# EAGLE design M868pld (EAGLE 6.6.0)
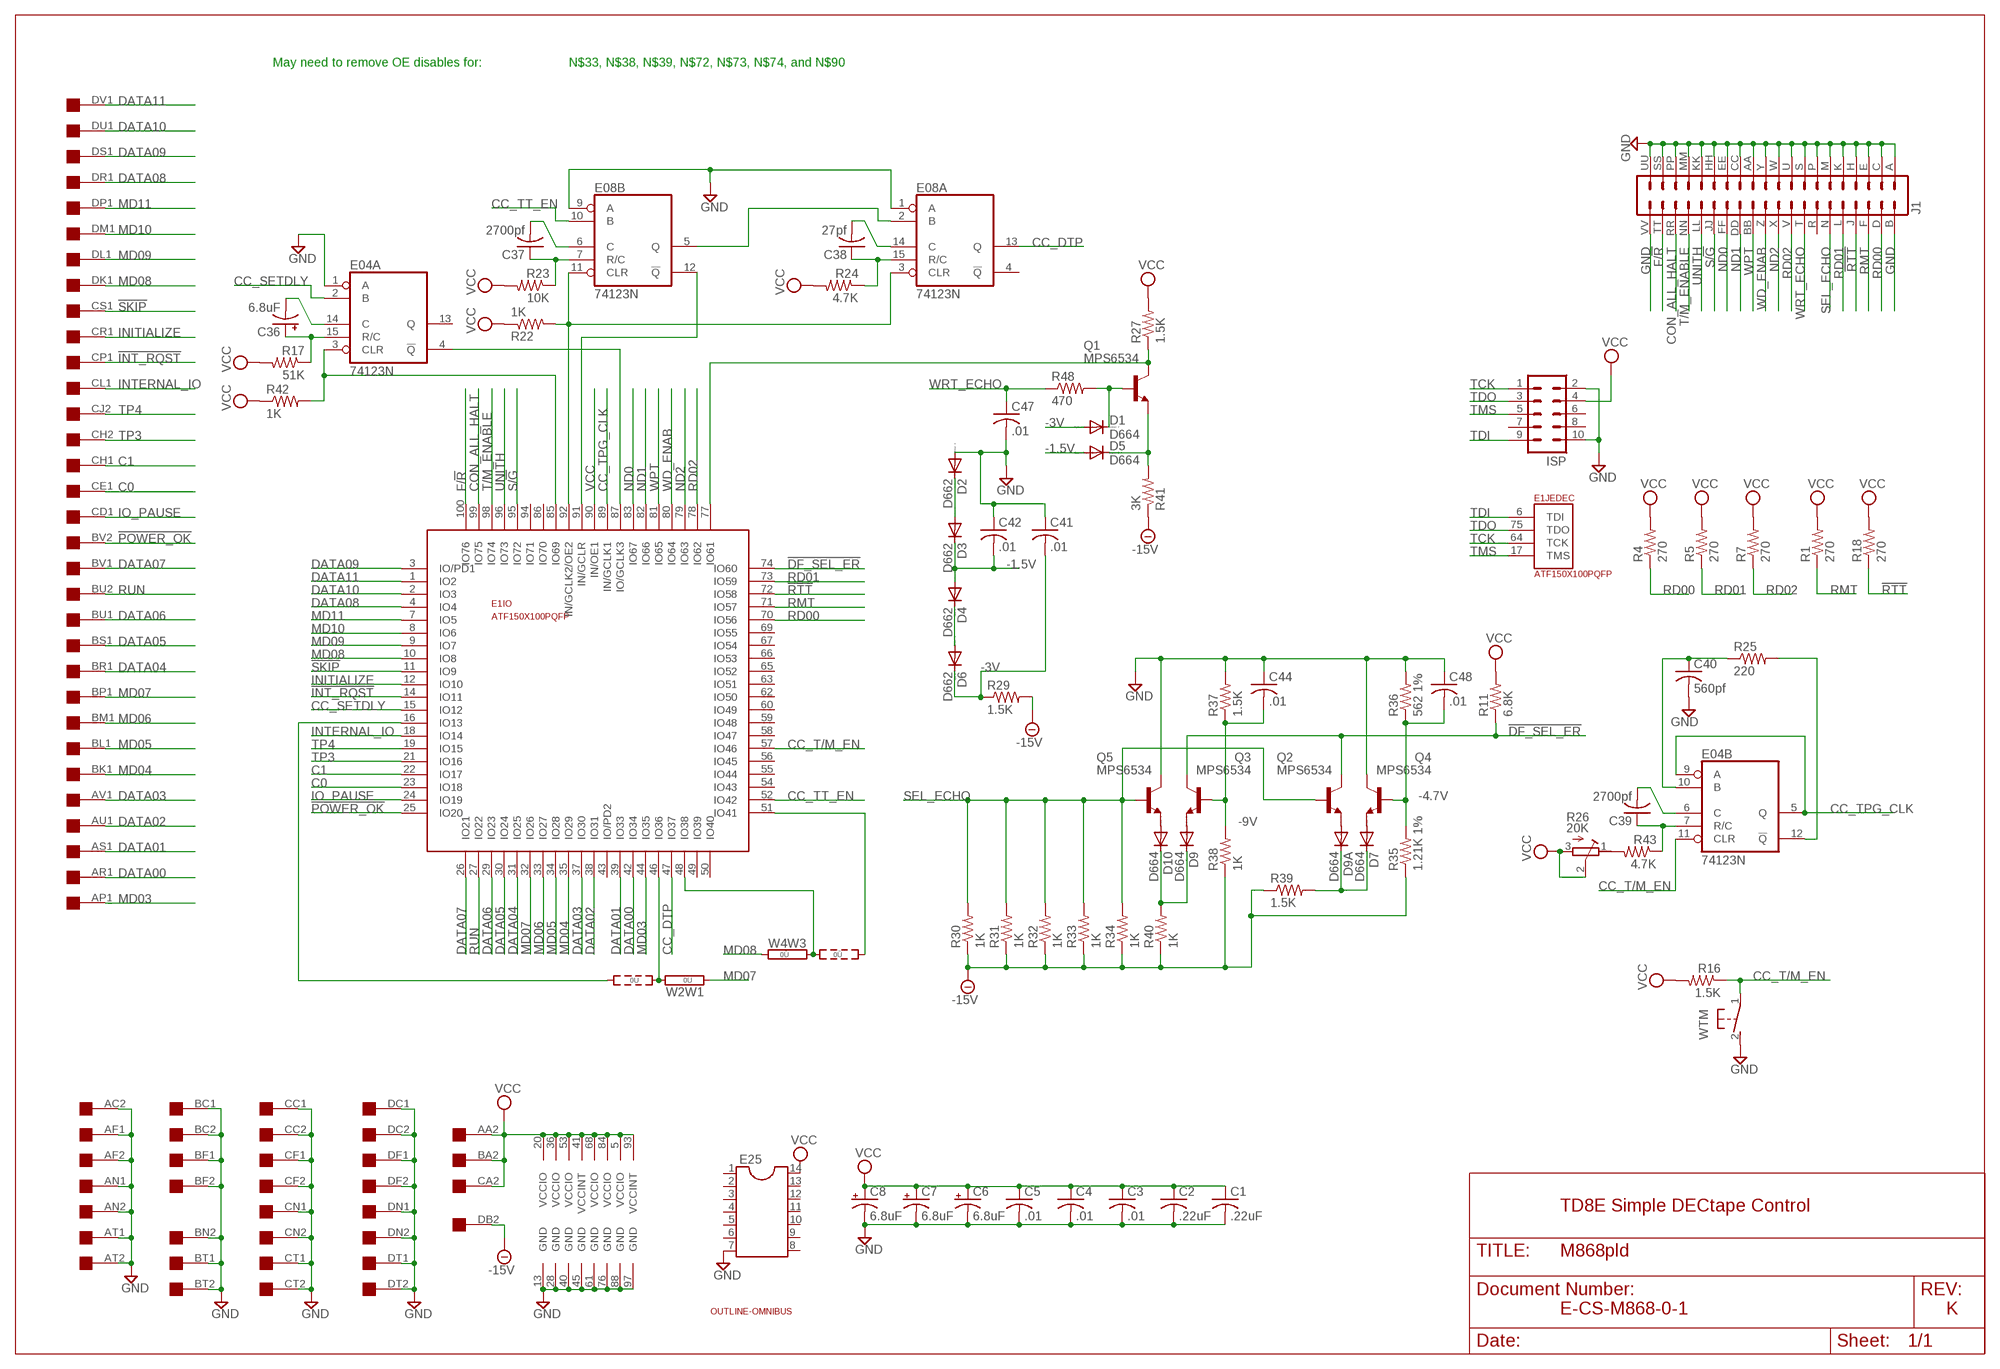
[diagram p0: schematic, sheet 1]

## Parts
C1  .22uF  C-US050-025X075  [C050-025X075]
C2  .22uF  C-US050-025X075  [C050-025X075]
C3  .01  C-US050-025X075  [C050-025X075]
C4  .01  C-US050-025X075  [C050-025X075]
C5  .01  C-US050-025X075  [C050-025X075]
C6  6.8uF  CPOL-USE20-8AXIAL  [E12-8]
C7  6.8uF  CPOL-USE20-8AXIAL  [E12-8]
C8  6.8uF  CPOL-USE20-8AXIAL  [E12-8]
C36  6.8uF  CPOL-USE20-8AXIAL  [E12-8]
C37  2700pf  C-US102-043X133  [C102-043X133]
C38  27pf  C-US050-025X075  [C050-025X075]
C39  2700pf  C-US102-043X133  [C102-043X133]
C40  560pf  C-US075-032X103  [C075-032X103]
C41  .01  C-US050-025X075  [C050-025X075]
C42  .01  C-US050-025X075  [C050-025X075]
C44  .01  C-US050-025X075  [C050-025X075]
C47  .01  C-US050-025X075  [C050-025X075]
C48  .01  C-US050-025X075  [C050-025X075]
D1  D664  1N4148DO35-10  [DO35-10]
D2  D662  1N4148DO35-10  [DO35-10]
D3  D662  1N4148DO35-10  [DO35-10]
D4  D662  1N4148DO35-10  [DO35-10]
D5  D664  1N4148DO35-10  [DO35-10]
D6  D662  1N4148DO35-10  [DO35-10]
D7  D664  1N4148DO35-10  [DO35-10]
D9  D664  1N4148DO35-10  [DO35-10]
D9A  D664  1N4148DO35-10  [DO35-10]
D10  D664  1N4148DO35-10  [DO35-10]
E1  ATF150X100PQFP  [PQFP-100]
E04  74123N  [DIL16]
E08  74123N  [DIL16]
E25  DIL14  [DIL14]
EDGE$3  QUAD  [EDGE-CON8]
ISP  MA05-2  [MA05-2]
J1  DEC40PINH  [DEC40PINH]
Q1  MPS6534  2N2219  [TO5]
Q2  MPS6534  2N2219  [TO5]
Q3  MPS6534  2N2219  [TO5]
Q4  MPS6534  2N2219  [TO5]
Q5  MPS6534  2N2219  [TO5]
R1  270  R-US_0207/10  [0207/10]
R4  270  R-US_0207/10  [0207/10]
R5  270  R-US_0207/10  [0207/10]
R7  270  R-US_0207/10  [0207/10]
R11  6.8K  R-US_0207/10  [0207/10]
R16  1.5K  R-US_0207/10  [0207/10]
R17  51K  R-US_0207/10  [0207/10]
R18  270  R-US_0207/10  [0207/10]
R22  1K  R-US_0207/10  [0207/10]
R23  10K  R-US_0207/10  [0207/10]
R24  4.7K  R-US_0207/10  [0207/10]
R25  220  R-US_0207/10  [0207/10]
R26  20K  275P  [3006Y]
R27  1.5K  R-US_0207/10  [0207/10]
R29  1.5K  R-US_0207/10  [0207/10]
R30  1K  R-US_0207/10  [0207/10]
R31  1K  R-US_0207/10  [0207/10]
R32  1K  R-US_0207/10  [0207/10]
R33  1K  R-US_0207/10  [0207/10]
R34  1K  R-US_0207/10  [0207/10]
R35  1.21K 1%  R-US_0207/15  [0207/15]
R36  562 1%  R-US_0207/15  [0207/15]
R37  1.5K  R-US_0207/10  [0207/10]
R38  1K  R-US_0207/10  [0207/10]
R39  1.5K  R-US_0207/10  [0207/10]
R40  1K  R-US_0207/10  [0207/10]
R41  3K  R-US_0207/10  [0207/10]
R42  1K  R-US_0207/10  [0207/10]
R43  4.7K  R-US_0207/10  [0207/10]
R48  470  R-US_0207/10  [0207/10]
U$1  OUTLINE-OMNIBUS  [OMNIBUS]
W2W1  0R2  [0R2/10]
W4W3  0R2  [0R2/10]
WTM  31-XX  [B3F-31XX]

## Nets
!CC_TPG_CLK: C40.1 E04.10(B:B) R25.1
!DF_SEL_ER: E1.74(IO:IO60) Q2.3(C) Q3.3(C) R11.1
!INT_RQST: E1.14(IO:IO11) EDGE$3.CP1
!POWER_OK: E1.25(IO:IO20) EDGE$3.BV2
!RTT: E1.72(IO:IO58) J1.J R18.1
!SKIP: E1.11(IO:IO9) EDGE$3.CS1
-1.5V: C42.2 D3.C D4.A D5.A
-3V: C41.2 D1.A D6.C R29.1
-4.7V: C48.2 Q4.2(B) R35.2 R36.1
-9V: C44.2 Q3.2(B) R37.1 R38.2
-15V [supply]: EDGE$3.DB2 R29.2 R30.1 R31.1 R32.1 R33.1 R34.1 R35.1 R38.1 R39.1 R40.1 R41.1
C0: E1.23(IO:IO18) EDGE$3.CE1
C1: E1.22(IO:IO17) EDGE$3.CH1
CC_DTP: E1.47(IO:IO37) E08.13(A:Q)
CC_SETDLY: E1.15(IO:IO12) E04.2(A:B)
CC_T/M_EN: E1.57(IO:IO46) E04.11(B:CLR) R16.1 WTM.1(P)
CC_TPG_CLK: E1.89(IO:IN/GCLK1) E04.5(B:Q) E04.9(B:A)
CC_TT_EN: E1.52(IO:IO42) E08.10(B:B)
CON_ALL_HALT: E1.99(IO:IO75) J1.RR
DATA00: E1.42(IO:IO34) EDGE$3.AR1
DATA01: E1.39(IO:IO33) EDGE$3.AS1
DATA02: E1.38(IO:IO31) EDGE$3.AU1
DATA03: E1.37(IO:IO30) EDGE$3.AV1
DATA04: E1.31(IO:IO25) EDGE$3.BR1
DATA05: E1.30(IO:IO24) EDGE$3.BS1
DATA06: E1.29(IO:IO23) EDGE$3.BU1
DATA07: E1.26(IO:IO21) EDGE$3.BV1
DATA08: E1.4(IO:IO4) EDGE$3.DR1
DATA09: E1.3(IO:IO/PD1) EDGE$3.DS1
DATA10: E1.2(IO:IO3) EDGE$3.DU1
DATA11: E1.1(IO:IO2) EDGE$3.DV1
F/!R: E1.100(IO:IO76) J1.TT
GND: C1.2 C2.2 C3.2 C4.2 C5.2 C6.- C7.- C8.- C40.2 C41.1 C42.1 C44.1 C47.2 C48.1 D2.A E1.13(GND) E1.28(GND) E1.40(GND) E1.45(GND) E1.61(GND) E1.76(GND) E1.88(GND) E1.97(GND) E04.1(A:A) E08.1(A:A) E08.9(B:A) E25.7 EDGE$3.AC2 EDGE$3.AF1 EDGE$3.AF2 EDGE$3.AN1 EDGE$3.AN2 EDGE$3.AT1 EDGE$3.AT2 EDGE$3.BC1 EDGE$3.BC2 EDGE$3.BF1 EDGE$3.BF2 EDGE$3.BN2 EDGE$3.BT1 EDGE$3.BT2 EDGE$3.CC1 EDGE$3.CC2 EDGE$3.CF1 EDGE$3.CF2 EDGE$3.CN1 EDGE$3.CN2 EDGE$3.CT1 EDGE$3.CT2 EDGE$3.DC1 EDGE$3.DC2 EDGE$3.DF1 EDGE$3.DF2 EDGE$3.DN1 EDGE$3.DN2 EDGE$3.DT1 EDGE$3.DT2 ISP.2 ISP.10 J1.A J1.AA J1.B J1.C J1.CC J1.E J1.EE J1.H J1.HH J1.K J1.KK J1.M J1.MM J1.P J1.PP J1.S J1.SS J1.U J1.UU J1.VV J1.W J1.Y Q4.3(C) Q5.3(C) R36.2 R37.2 WTM.2(S)
INITIALIZE: E1.12(IO:IO10) EDGE$3.CR1
INTERNAL_IO: E1.18(IO:IO14) EDGE$3.CL1
IO_PAUSE: E1.24(IO:IO19) EDGE$3.CD1
MD03: E1.44(IO:IO35) EDGE$3.AP1
MD04: E1.35(IO:IO29) EDGE$3.BK1
MD05: E1.34(IO:IO28) EDGE$3.BL1
MD06: E1.33(IO:IO27) EDGE$3.BM1
MD07: E1.32(IO:IO26) EDGE$3.BP1 W2W1.1
MD08: E1.10(IO:IO8) EDGE$3.DK1 W4W3.1
MD09: E1.9(IO:IO7) EDGE$3.DL1
MD10: E1.8(IO:IO6) EDGE$3.DM1
MD11: E1.7(IO:IO5) EDGE$3.DP1
N$17: E1.92(IO:IN/GCLK2/OE2) E08.3(A:CLR) E08.11(B:CLR) R22.2
N$51: D1.C Q1.2(B) R48.2
N$52: D5.C Q1.1(E) R41.2
N$53: E1.77(IO:IO61) Q1.3(C) R27.1
N$54: D2.C D3.A
N$55: D9.C D10.C R40.2
N$56: D4.C D6.A
N$57: D10.A Q5.1(E)
N$58: D9.A Q3.1(E)
N$59: D9A.A Q2.1(E)
N$60: D7.A Q4.1(E)
N$61: E1.46(IO:IO36) W2W1.2
N$62: E1.48(IO:IO38) W4W3.2
N$63: D7.C D9A.C R39.2
N$65: E1.16(IO:IO13) W2W1.3
N$67: E1.51(IO:IO41) W4W3.3
N$77: E08.2(A:B) E08.5(B:Q)
N$78: C37.1 E08.7(B:R/C) R23.1
N$79: C38.1 E08.15(A:R/C) R24.1
N$80: E1.91(IO:IN/GCLR) E08.12(B:!Q)
N$81: C38.2 E08.14(A:C)
N$82: C37.2 E08.6(B:C)
N$92: E1.85(IO:IO69) E04.3(A:CLR) R42.2
N$94: C36.+ E04.15(A:R/C) R17.1
N$95: C36.- E04.14(A:C)
N$96: E1.87(IO:IO/GCLK3) E04.4(A:!Q)
N$108: C39.1 E04.7(B:R/C) R43.1
N$110: C39.2 E04.6(B:C)
N$111: R26.1(A) R43.2
N$112: E04.12(B:!Q) R25.2
ND0: E1.83(IO:IO67) J1.FF
ND1: E1.82(IO:IO66) J1.DD
ND2: E1.79(IO:IO63) J1.X
RD00: E1.70(IO:IO56) J1.D R4.1
RD01: E1.73(IO:IO59) J1.L R5.1
RD02: E1.78(IO:IO62) J1.V R7.1
RMT: E1.71(IO:IO57) J1.F R1.1
RUN: E1.27(IO:IO22) EDGE$3.BU2
S/!G: E1.95(IO:IO72) J1.JJ
SEL_ECHO: J1.N Q2.2(B) Q5.2(B) R30.2 R31.2 R32.2 R33.2 R34.2
T/M_ENABLE: E1.98(IO:IO74) J1.NN
TCK: E1.64(JEDEC:TCK) ISP.1
TDI: E1.6(JEDEC:TDI) ISP.9
TDO: E1.75(JEDEC:TDO) ISP.3
TMS: E1.17(JEDEC:TMS) ISP.5
TP3: E1.21(IO:IO16) EDGE$3.CH2
TP4: E1.19(IO:IO15) EDGE$3.CJ2
UNITH: E1.96(IO:IO73) J1.LL
VCC [supply]: C1.1 C2.1 C3.1 C4.1 C5.1 C6.+ C7.+ C8.+ E1.5(VCCIO) E1.20(VCCIO) E1.36(VCCIO) E1.41(VCCINT) E1.53(VCCIO) E1.68(VCCIO) E1.84(VCCIO) E1.90(IO:IN/OE1) E1.93(VCCINT) E25.14 EDGE$3.AA2 EDGE$3.BA2 EDGE$3.CA2 ISP.4 R1.2 R4.2 R5.2 R7.2 R11.2 R16.2 R17.2 R18.2 R22.1 R23.2 R24.2 R26.2(S) R26.3(E) R27.2 R42.1
WD_ENAB: E1.80(IO:IO64) J1.Z
WPT: E1.81(IO:IO65) J1.BB
WRT_ECHO: C47.1 J1.T R48.1
Unconnected: E1.43(IO:IO/PD2) E1.49(IO:IO39) E1.50(IO:IO40) E1.54(IO:IO43) E1.55(IO:IO44) E1.56(IO:IO45) E1.58(IO:IO47) E1.59(IO:IO48) E1.60(IO:IO49) E1.62(IO:IO50) E1.63(IO:IO51) E1.65(IO:IO52) E1.66(IO:IO53) E1.67(IO:IO54) E1.69(IO:IO55) E1.86(IO:IO70) E1.94(IO:IO71) E04.13(A:Q) E08.4(A:!Q) E25.1 E25.2 E25.3 E25.4 E25.5 E25.6 E25.8 E25.9 E25.10 E25.11 E25.12 E25.13 EDGE$3.AA1 EDGE$3.AB1 EDGE$3.AB2 EDGE$3.AC1 EDGE$3.AD1 EDGE$3.AD2 EDGE$3.AE1 EDGE$3.AE2 EDGE$3.AH1 EDGE$3.AH2 EDGE$3.AJ1 EDGE$3.AJ2 EDGE$3.AK1 EDGE$3.AK2 EDGE$3.AL1 EDGE$3.AL2 EDGE$3.AM1 EDGE$3.AM2 EDGE$3.AP2 EDGE$3.AR2 EDGE$3.AS2 EDGE$3.AU2 EDGE$3.AV2 EDGE$3.BA1 EDGE$3.BB1 EDGE$3.BB2 EDGE$3.BD1 EDGE$3.BD2 EDGE$3.BE1 EDGE$3.BE2 EDGE$3.BH1 EDGE$3.BH2 EDGE$3.BJ1 EDGE$3.BJ2 EDGE$3.BK2 EDGE$3.BL2 EDGE$3.BM2 EDGE$3.BN1 EDGE$3.BP2 EDGE$3.BR2 EDGE$3.BS2 EDGE$3.CA1 EDGE$3.CB1 EDGE$3.CB2 EDGE$3.CD2 EDGE$3.CE2 EDGE$3.CJ1 EDGE$3.CK1 EDGE$3.CK2 EDGE$3.CL2 EDGE$3.CM1 EDGE$3.CM2 EDGE$3.CP2 EDGE$3.CR2 EDGE$3.CS2 EDGE$3.CU1 EDGE$3.CU2 EDGE$3.CV1 EDGE$3.CV2 EDGE$3.DA1 EDGE$3.DA2 EDGE$3.DB1 EDGE$3.DD1 EDGE$3.DD2 EDGE$3.DE1 EDGE$3.DE2 EDGE$3.DH1 EDGE$3.DH2 EDGE$3.DJ1 EDGE$3.DJ2 EDGE$3.DK2 EDGE$3.DL2 EDGE$3.DM2 EDGE$3.DP2 EDGE$3.DR2 EDGE$3.DS2 EDGE$3.DU2 EDGE$3.DV2 ISP.6 ISP.7 ISP.8 J1.R

## Notes on the sheet
- May need to remove OE disables for: | N$33, N$38, N$39, N$72, N$73, N$74, and N$90
- TD8E Simple DECtape Control
- E-CS-M868-0-1 | K

## Power pins joined to a net without a drawn wire
GND: E04.8(P:GND) E08.8(P:GND)
VCC: E04.16(P:VCC) E08.16(P:VCC)

## Library data of the parts
C1-C5 C37-C42 C44 C47 C48 = rcl:C-US: CAPACITOR, American symbol
C6-C8 C36 = dec-con:CPOL-USE20-8AXIAL: A 0.8 inch electrolytic.
D1-D7 D9 D9A D10 = diode:1N4148: DIODE high speed (Philips)
E1 = atmel-cpld:ATF150X100: ATF150x in 100 pin package.
E04 E08 = 74xx-us:74*123: Retriggerable monostable MULTIVIBRATOR
E25 = ic-package:DIL14: Dual In Line / Socket
EDGE$3 = dec-con:QUAD: Quad-Height DEC board
ISP = con-lstb:MA05-2: PIN HEADER; OC_FARNELL: unknown; OC_NEWARK: unknown
J1 = dec-con:DEC40PIN: PIN HEADER
Q1-Q5 = transistor-npn:2N2219: NPN Transistor
R1 R4 R5 R7 R11 R16-R18 R22-R25 R27 R29-R43 R48 = rcl:R-US_: RESISTOR, American symbol
R26 = dec-con:275P: Trimpot with 275P (3006Y) footprint.
U$1 = dec-con:OUTLINE-*: Board outlines for DEC boards.
W2W1 W4W3 = jumper:0R2: Bridge switch 0R 2 x 10mm
WTM = switch-omron:31-XX: OMRON SWITCH; MPN: B3F-3100; OC_FARNELL: 959704; OC_NEWARK: 36M3582

## Board
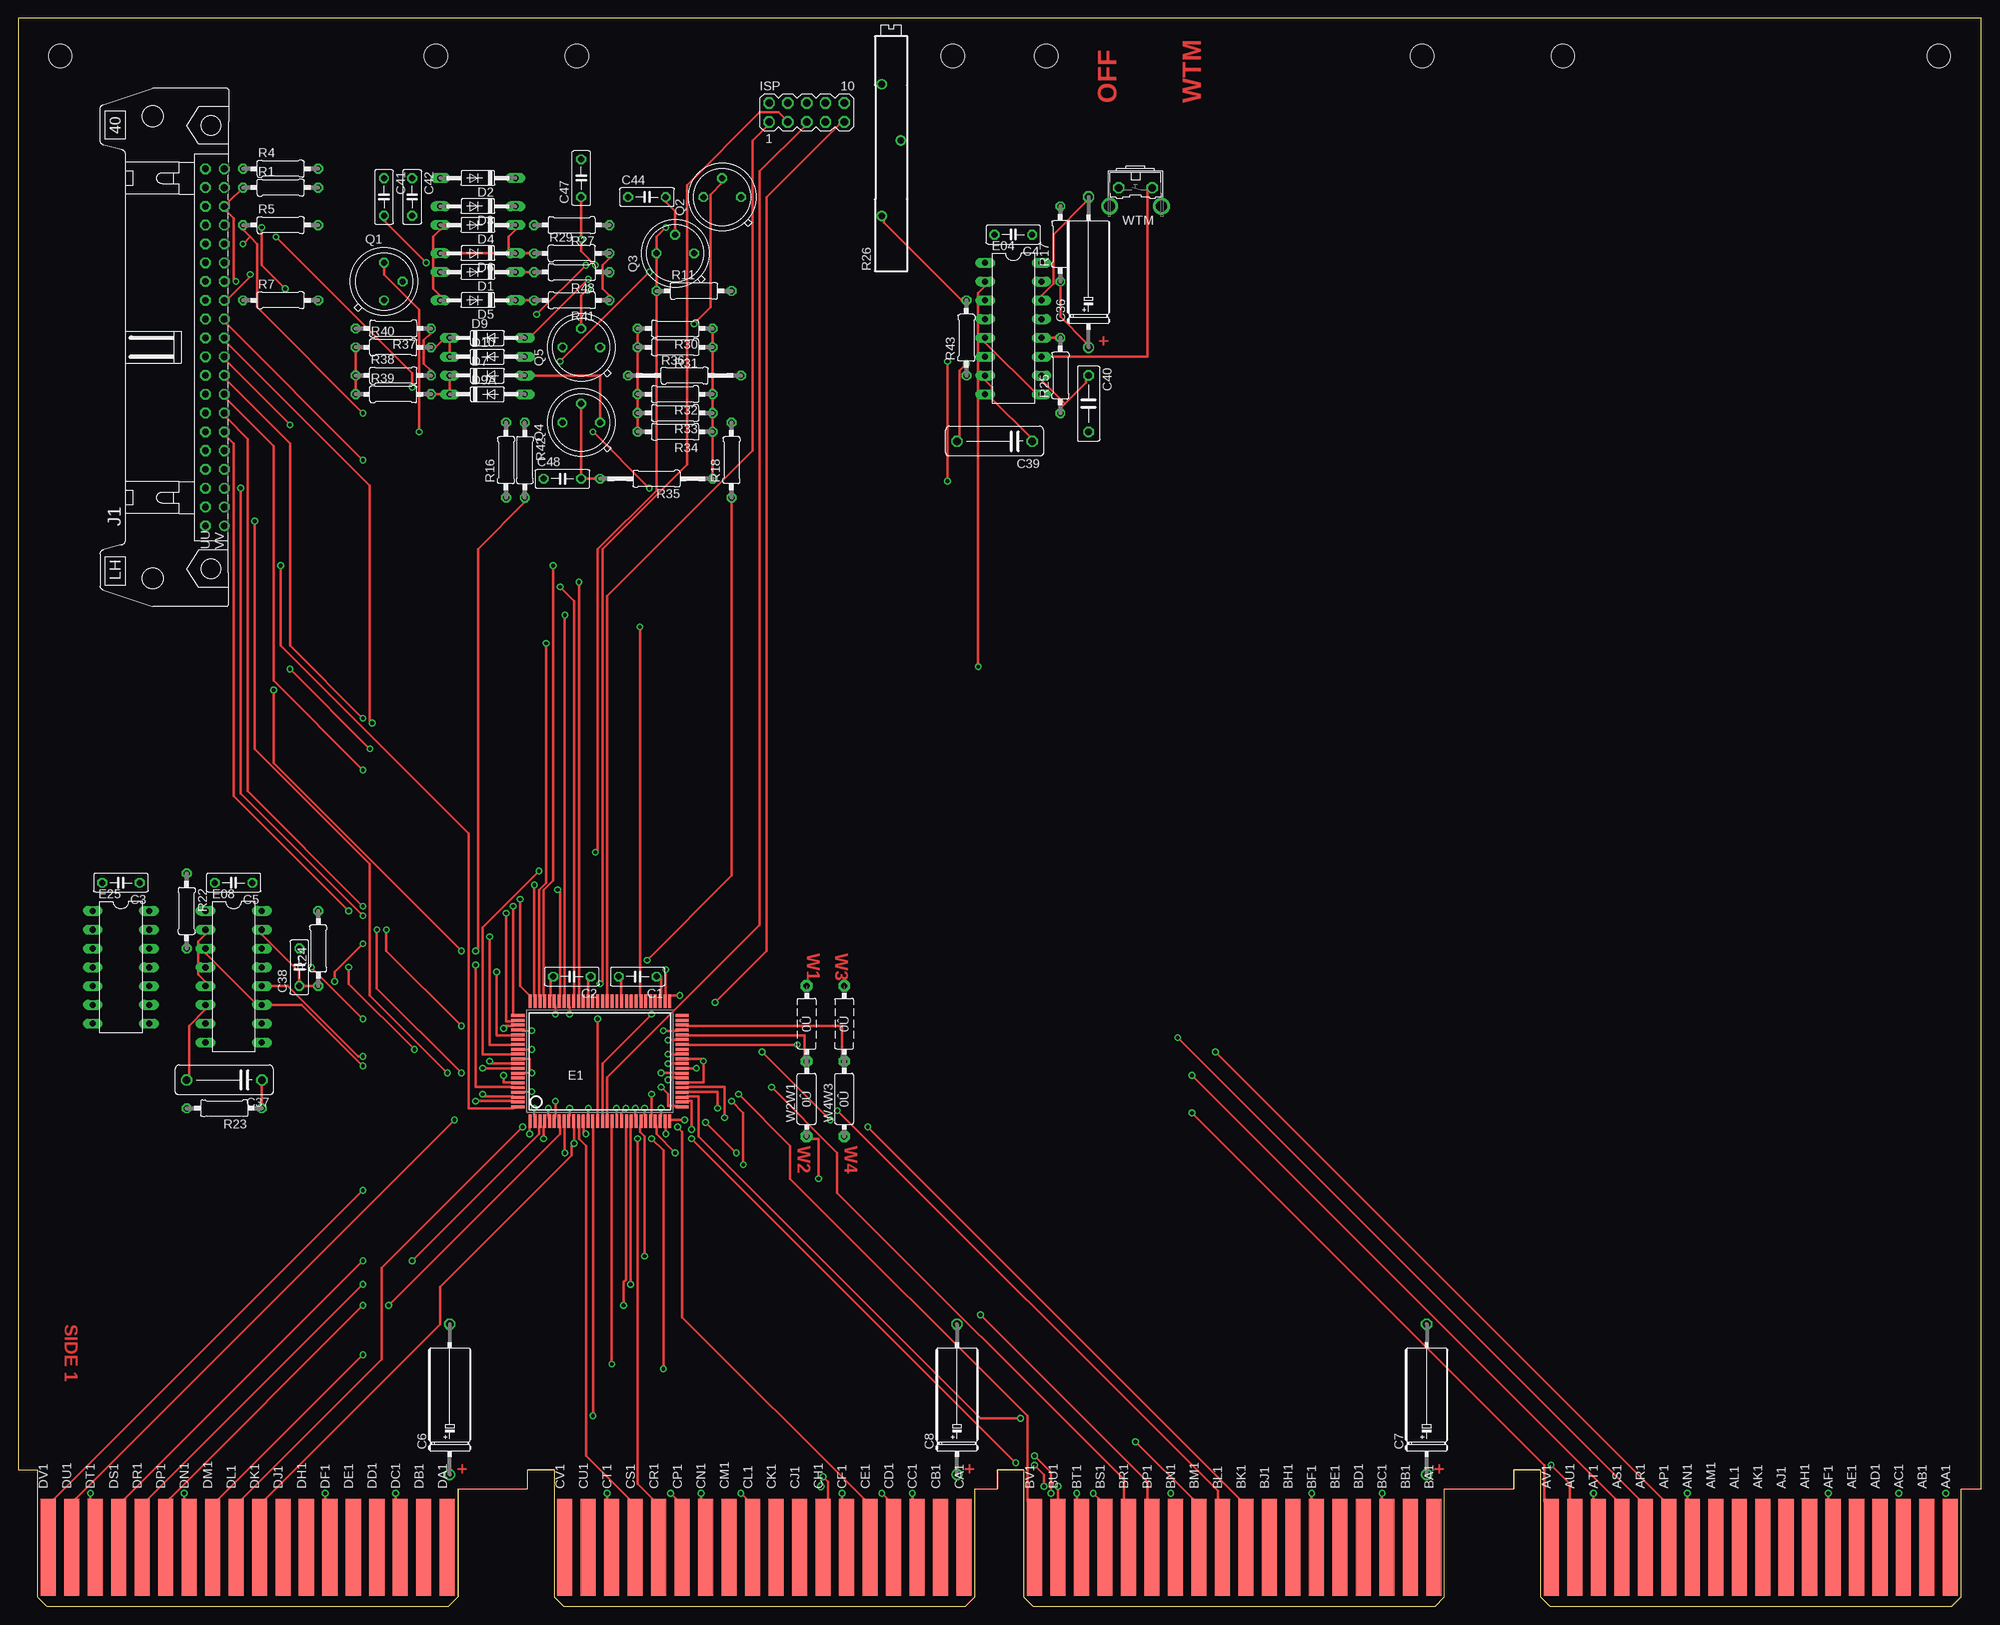
[diagram p1: board, top side]
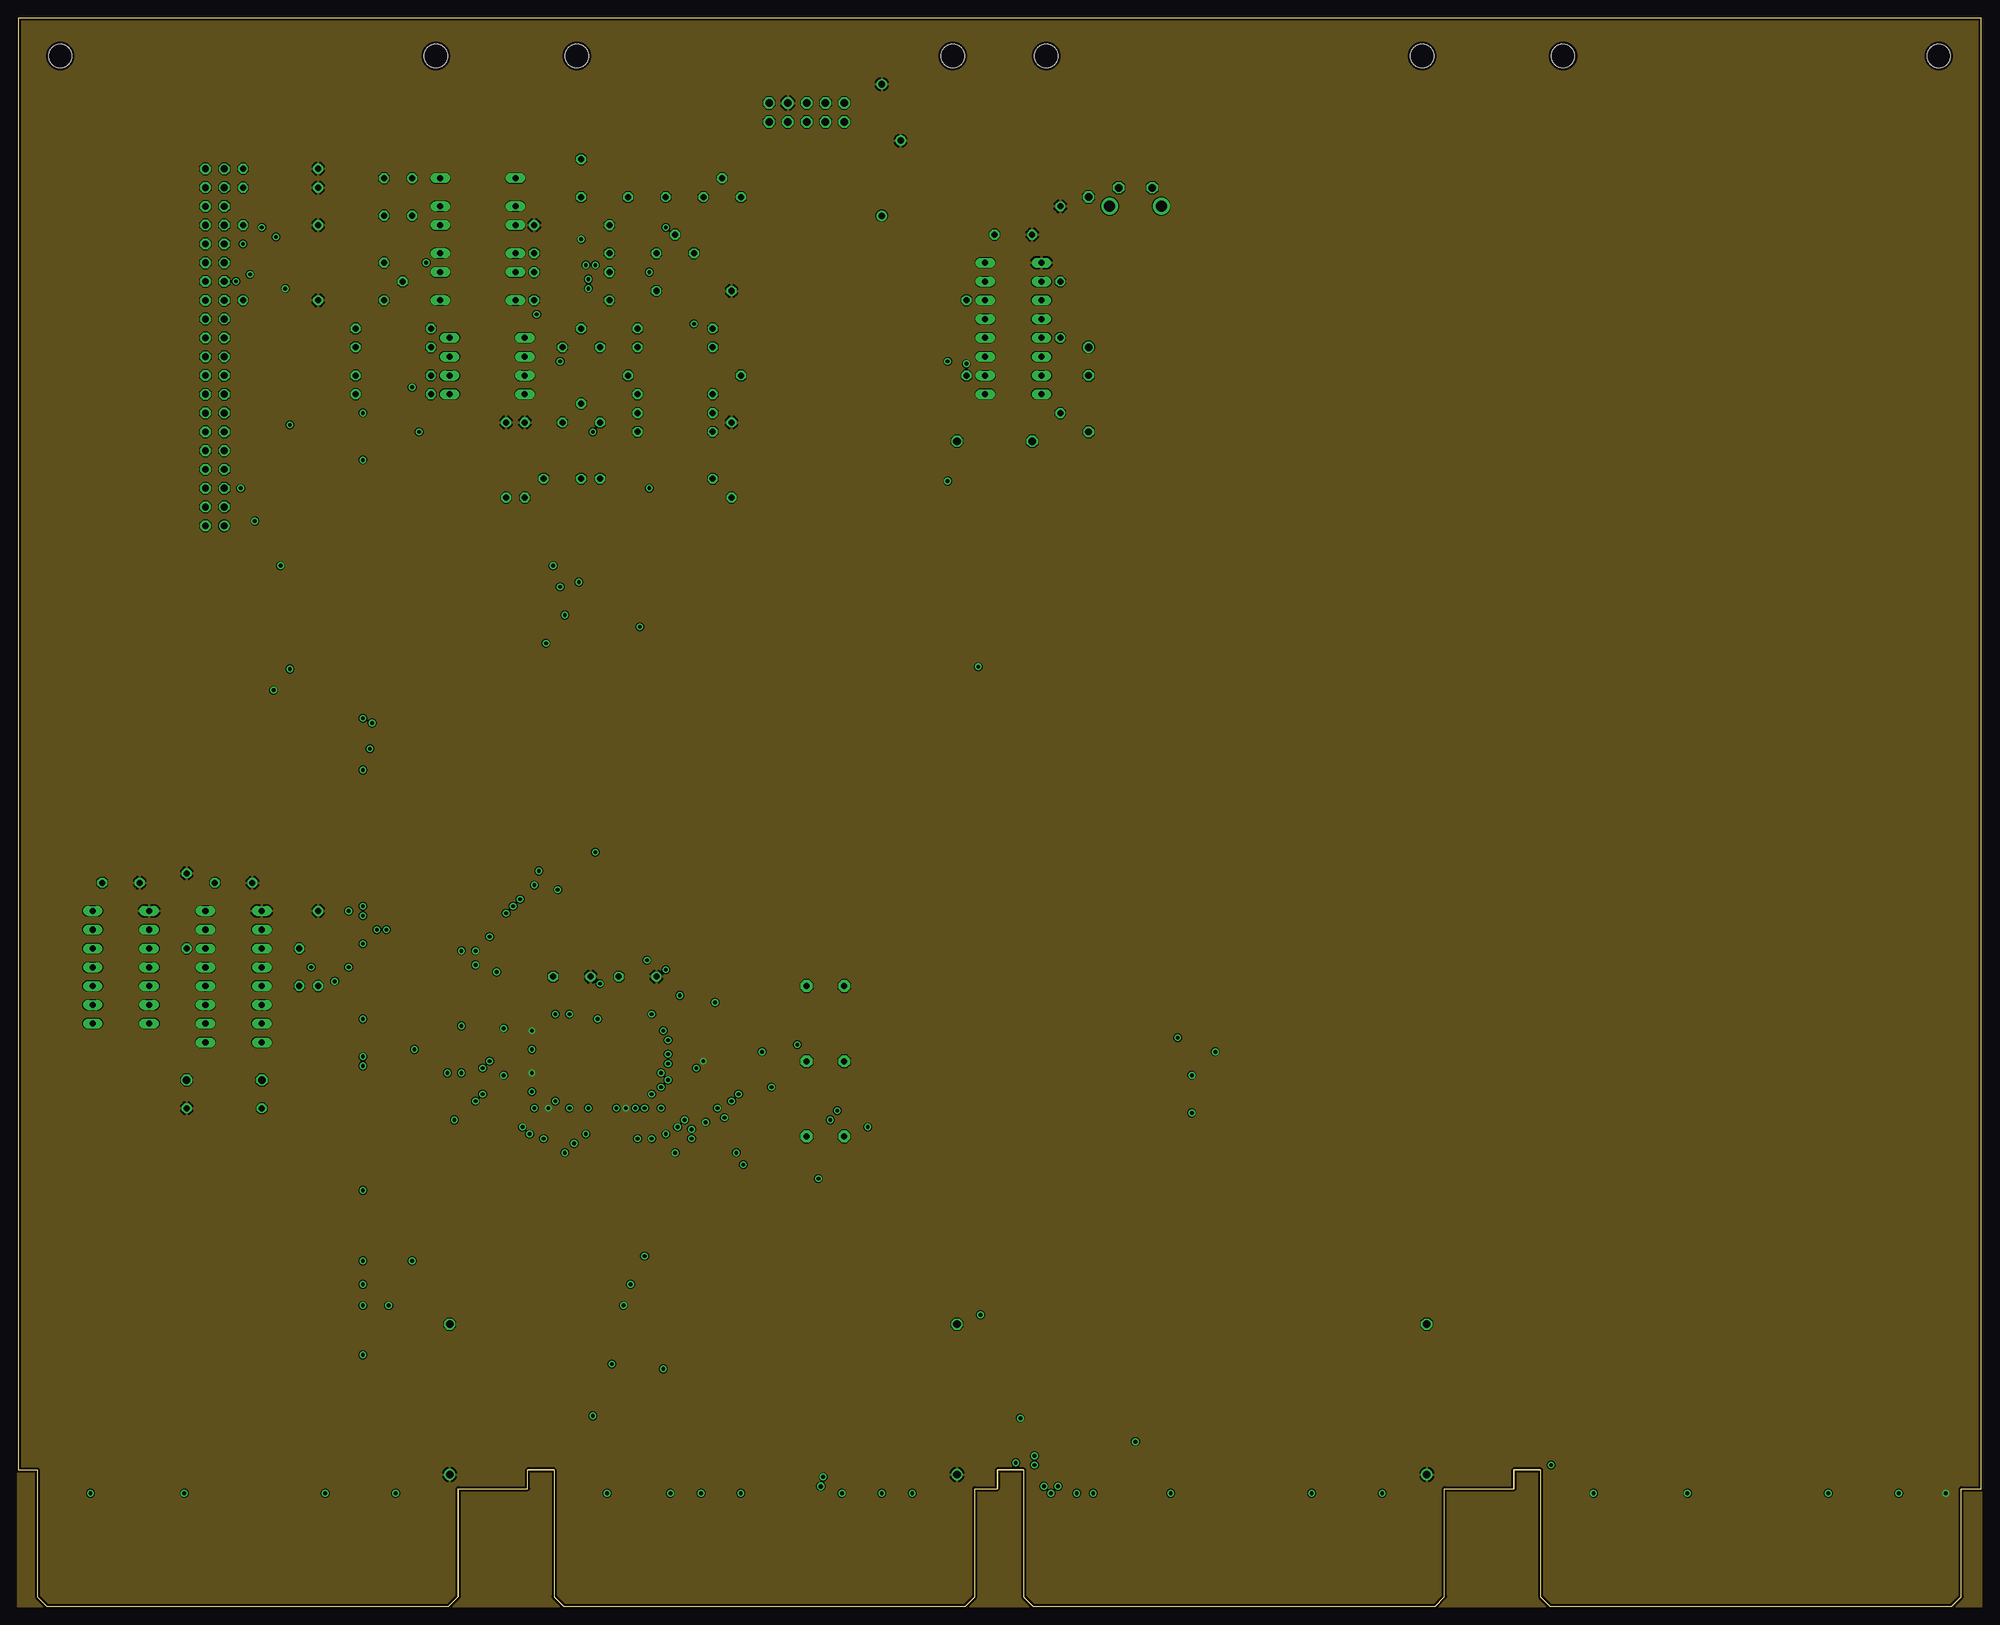
[diagram p2: board, inner layer VCC$]
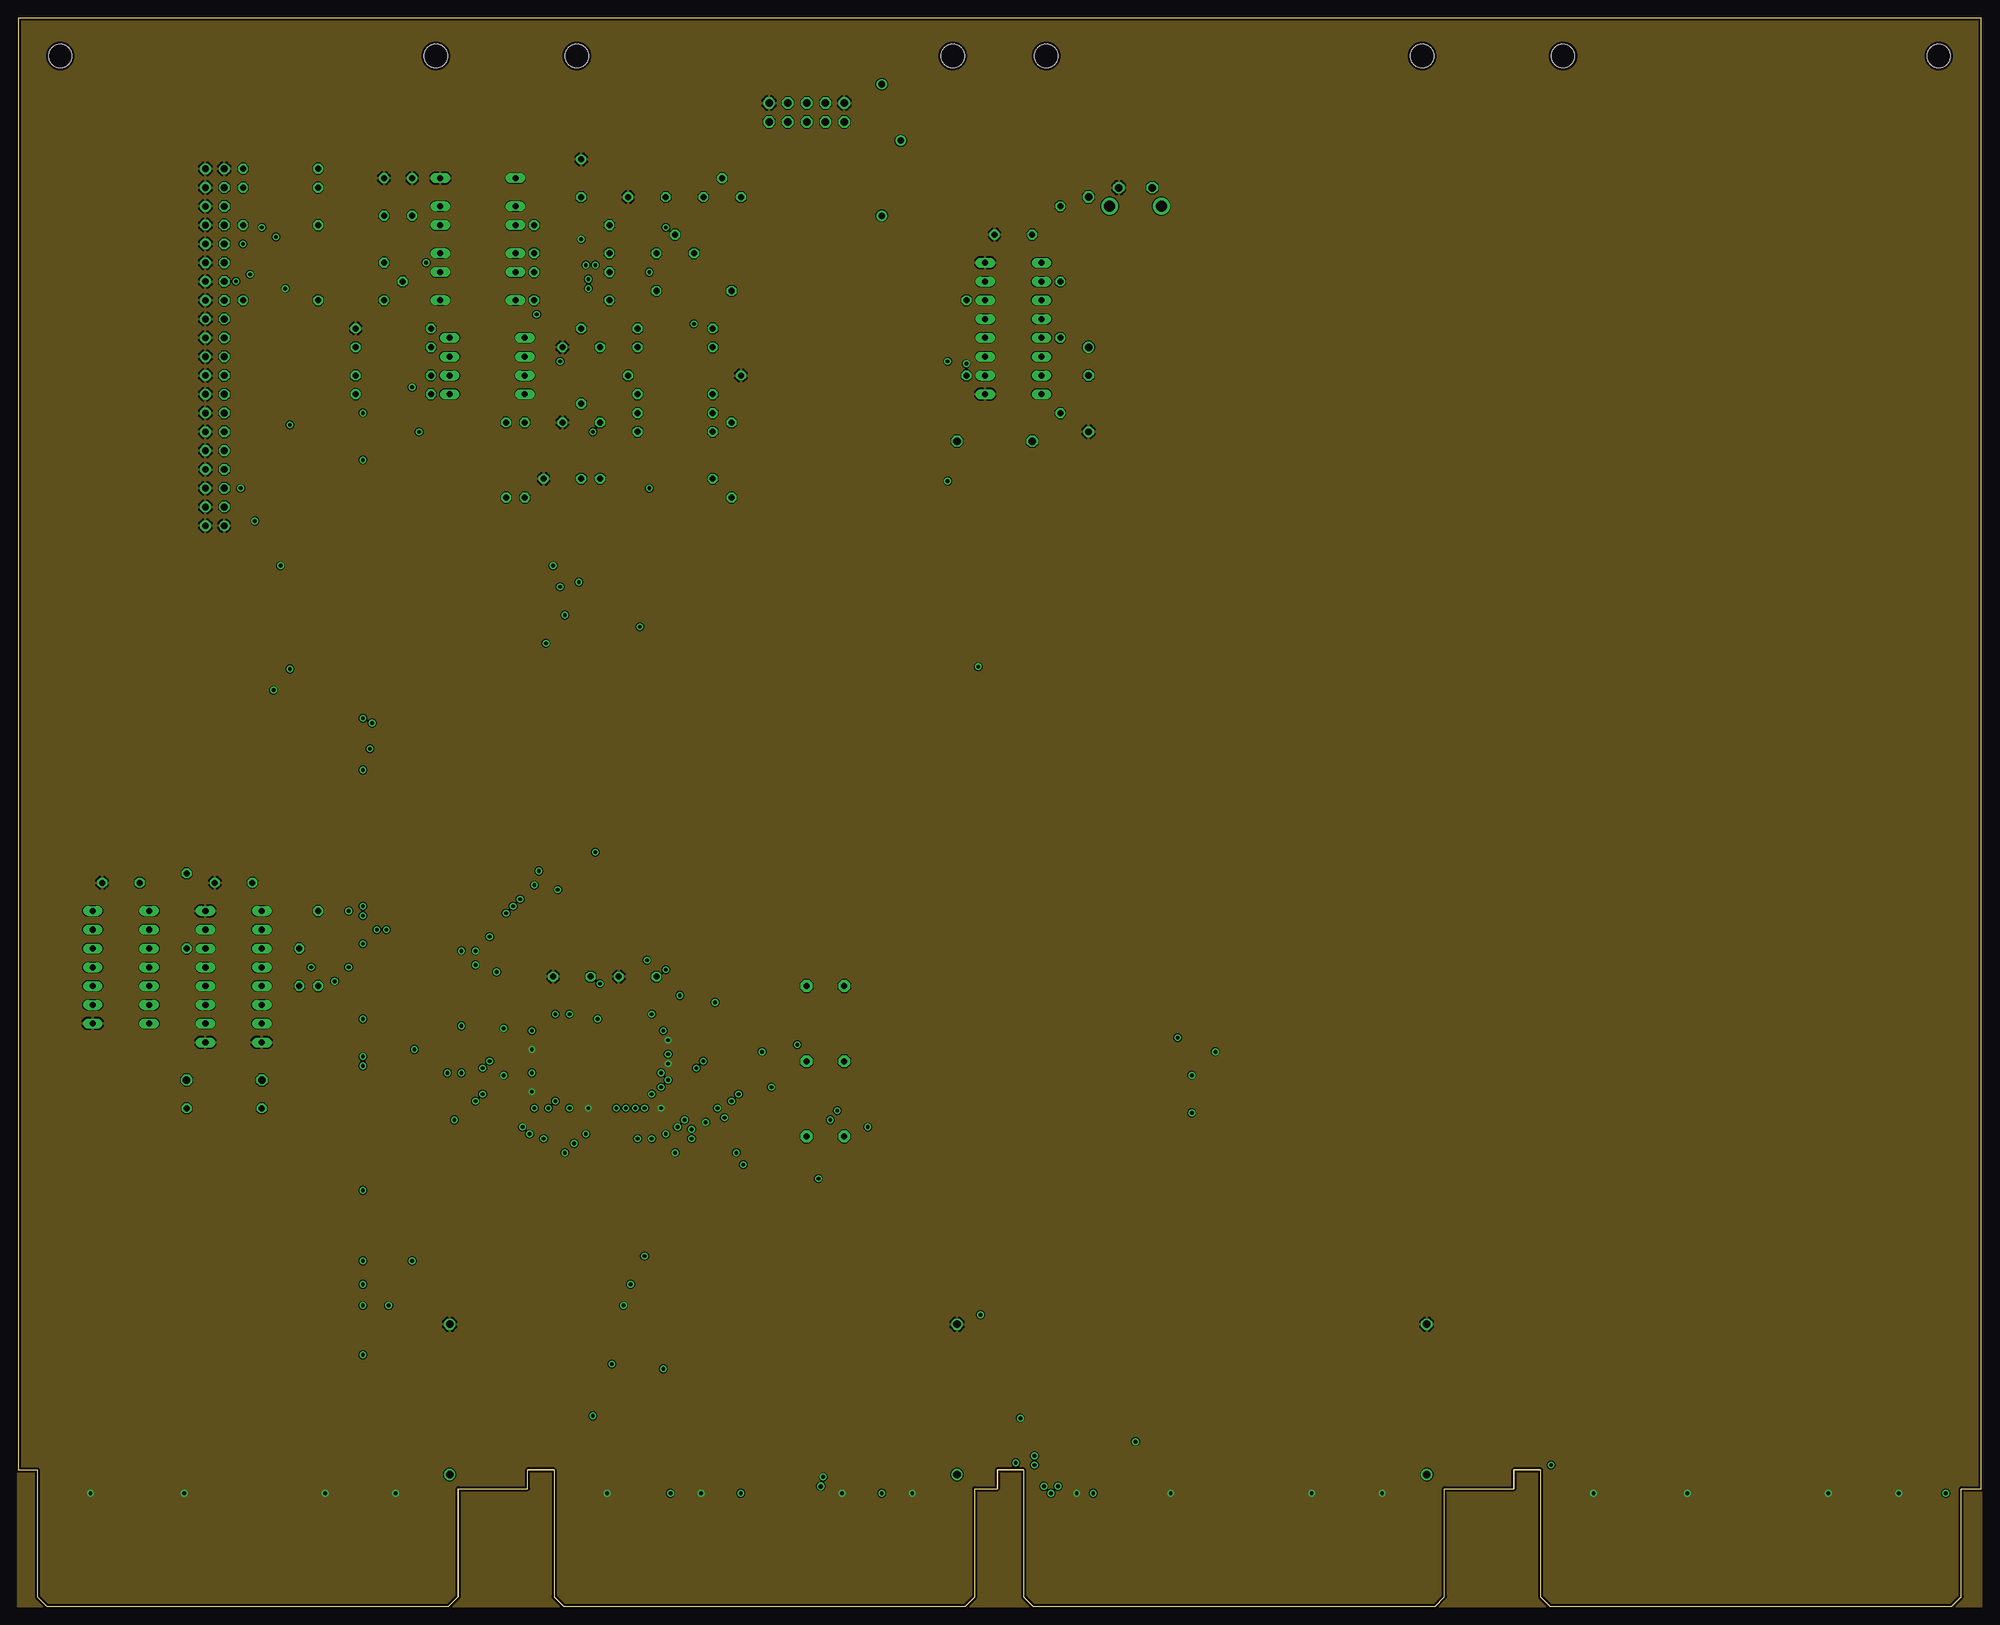
[diagram p3: board, inner layer GND$]
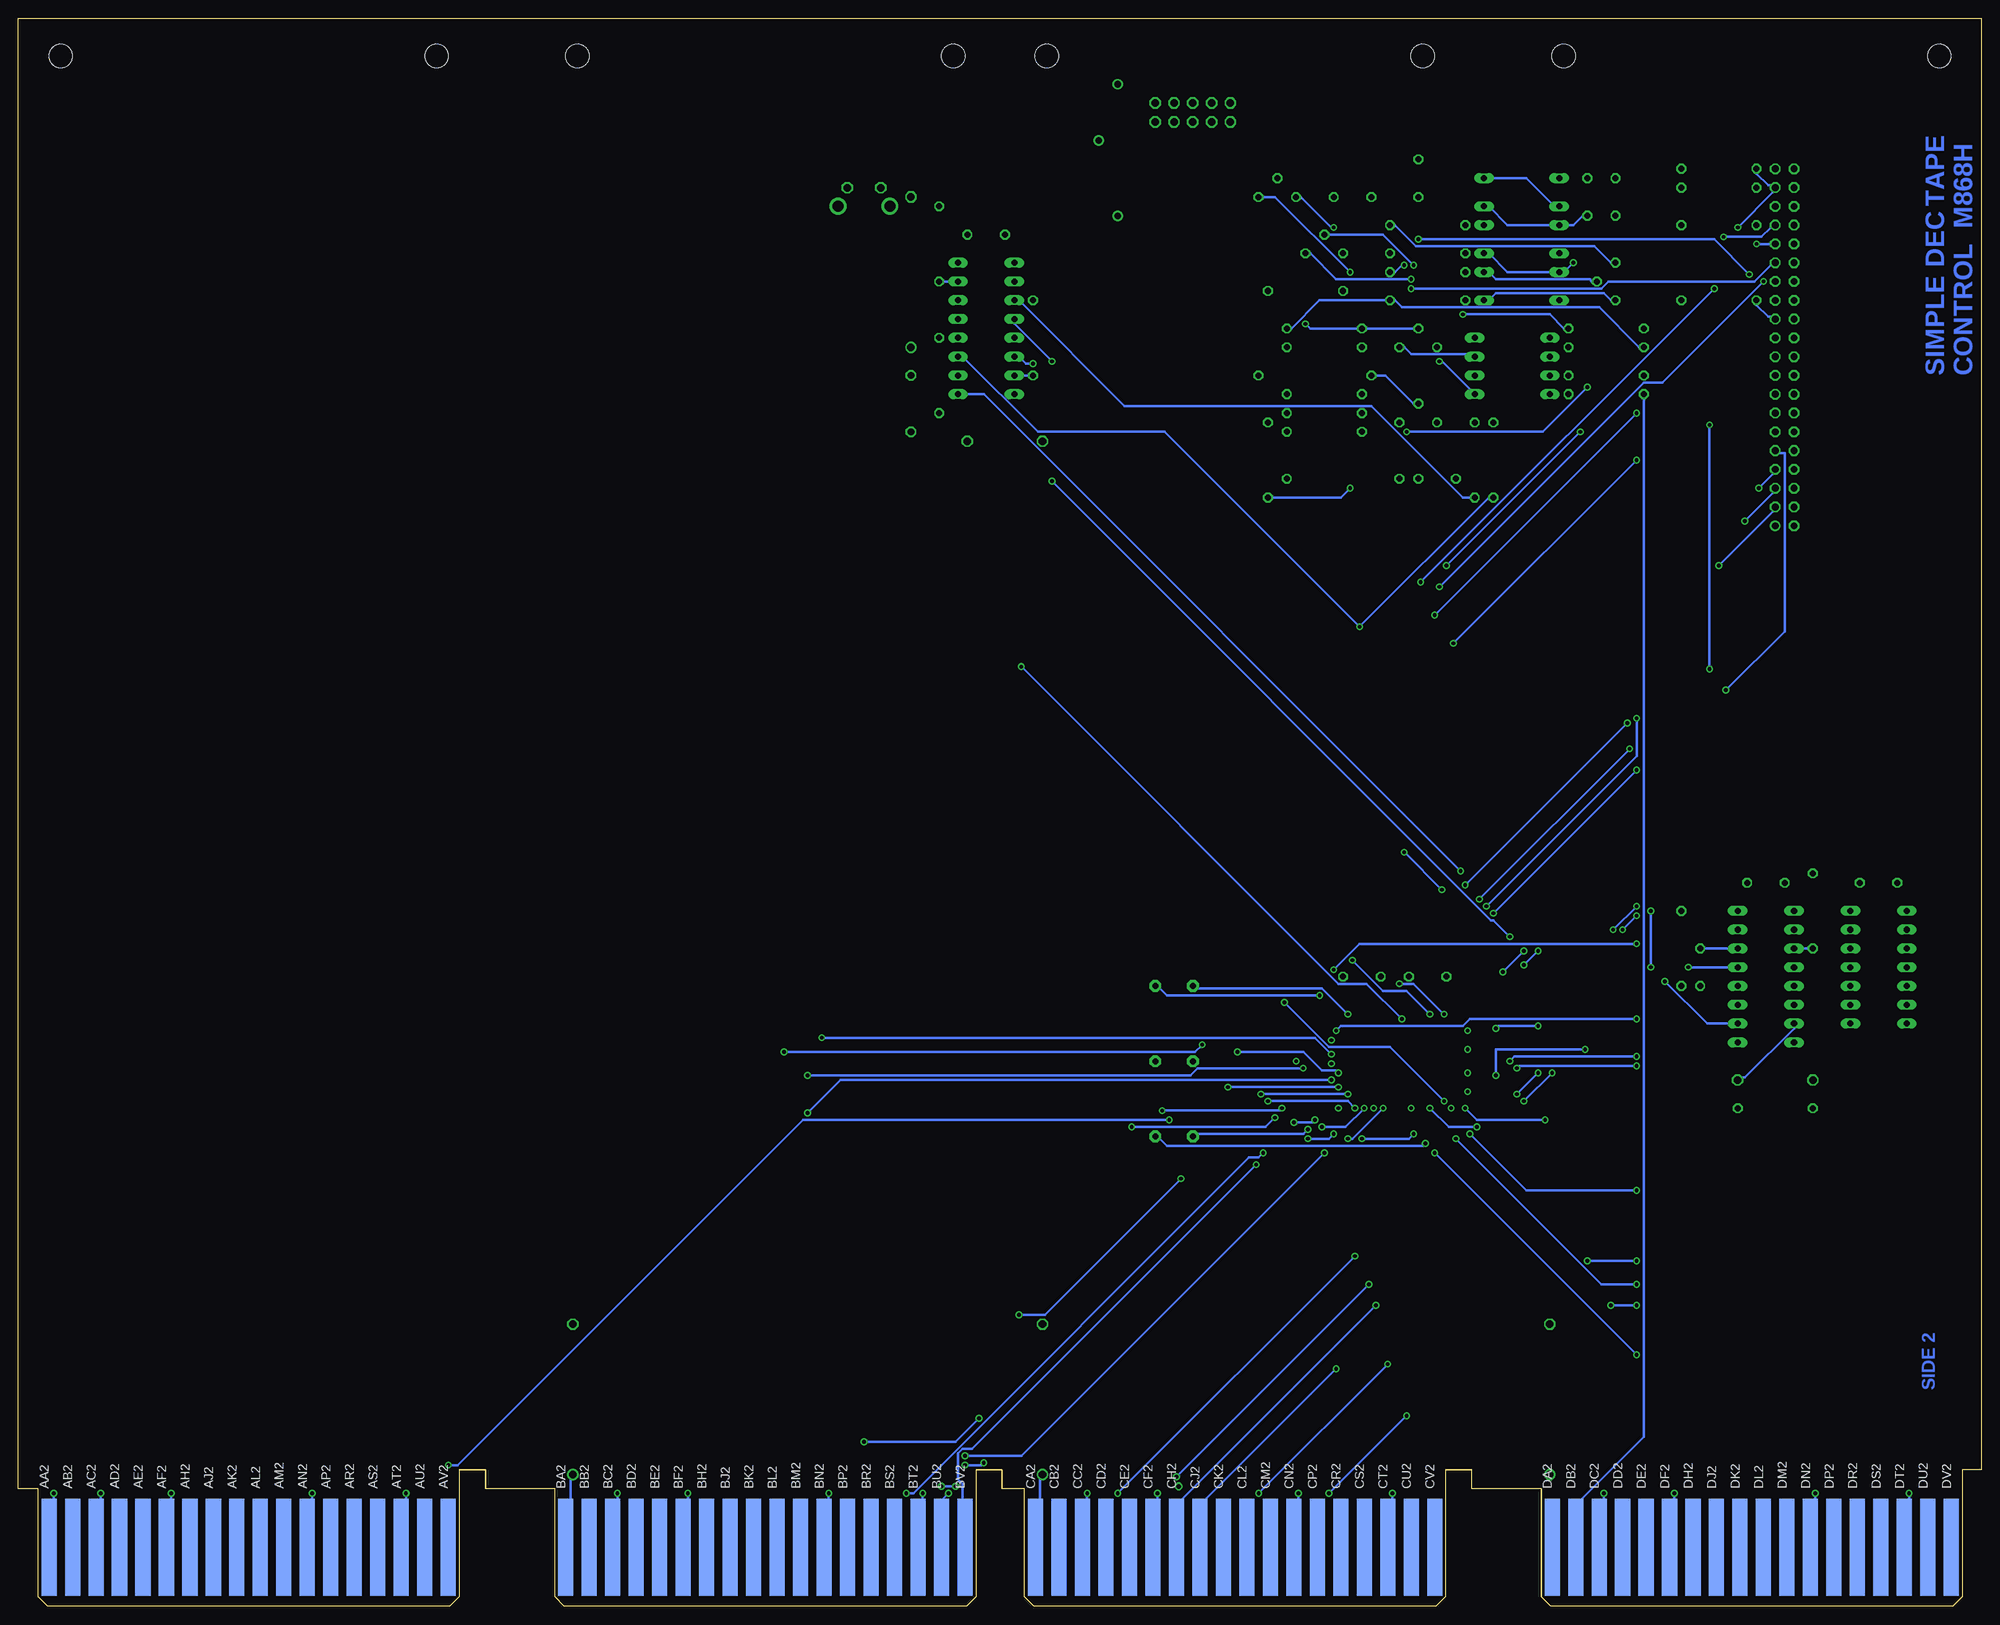
[diagram p4: board, bottom side, seen from below]

Size 265.3 x 214.63 mm. Coordinates in mm from the lower left corner, seen from the top.
Copper layers (1+2+3+16): Top 0.035mm / dielectric 1.5mm / VCC$ 0.035mm / dielectric 0.15mm / GND$ 0.035mm / dielectric 0.2mm / Bottom 0.035mm
Design rules "pld *": minimum track width 12mil, minimum drill 20mil, track to track 5mil, track to pad 5mil, pad to pad 5mil, via to via 10mil, smd to smd 5mil, copper to edge 13mil, drill to drill 10mil, minimum pad ring 10mil, minimum via ring 8mil, stop-mask expansion 0mil, vias tented up to drill 0mil, thermal gap 10mil

### Footprints (pad centres in the part's own frame; a part is rotated, then mirrored left to right if it is on the bottom)
C050-025X075 = drill 0.813 octagon: 1 -2.54,0; 2 2.54,0
E12-8 = drill 1.016: + -10.16,0 | drill 1.016 octagon: - 10.16,0
C102-043X133 = drill 1.016 octagon: 1 -5.08,0; 2 5.08,0
C075-032X103 = drill 0.914 octagon: 1 -3.81,0; 2 3.81,0
DO35-10 = drill 0.813 long: A 5.08,0; C -5.08,0
PQFP-100 = smd 0.4 x 1.8: 1 -9.425,-8.1; 2 -8.775,-8.1; 3 -8.125,-8.1; 4 -7.475,-8.1; 5 -6.825,-8.1; 6 -6.175,-8.1; 7 -5.525,-8.1; 8 -4.875,-8.1; 9 -4.225,-8.1; 10 -3.575,-8.1; 11 -2.925,-8.1; 12 -2.275,-8.1; 13 -1.625,-8.1; 14 -0.975,-8.1; 15 -0.325,-8.1; 16 0.325,-8.1; 17 0.975,-8.1; 18 1.625,-8.1; 19 2.275,-8.1; 20 2.925,-8.1; 21 3.575,-8.1; 22 4.225,-8.1; 23 4.875,-8.1; 24 5.525,-8.1; 25 6.175,-8.1; 26 6.825,-8.1; 27 7.475,-8.1; 28 8.125,-8.1; 29 8.775,-8.1; 30 9.425,-8.1; 51 9.425,8.1; 52 8.775,8.1; 53 8.125,8.1; 54 7.475,8.1; 55 6.825,8.1; 56 6.175,8.1; 57 5.525,8.1; 58 4.875,8.1; 59 4.225,8.1; 60 3.575,8.1; 61 2.925,8.1; 62 2.275,8.1; 63 1.625,8.1; 64 0.975,8.1; 65 0.325,8.1; 66 -0.325,8.1; 67 -0.975,8.1; 68 -1.625,8.1; 69 -2.275,8.1; 70 -2.925,8.1; 71 -3.575,8.1; 72 -4.225,8.1; 73 -4.875,8.1; 74 -5.525,8.1; 75 -6.175,8.1; 76 -6.825,8.1; 77 -7.475,8.1; 78 -8.125,8.1; 79 -8.775,8.1; 80 -9.425,8.1 | smd 1.8 x 0.4: 31 11.1,-6.175; 32 11.1,-5.525; 33 11.1,-4.875; 34 11.1,-4.225; 35 11.1,-3.575; 36 11.1,-2.925; 37 11.1,-2.275; 38 11.1,-1.625; 39 11.1,-0.975; 40 11.1,-0.325; 41 11.1,0.325; 42 11.1,0.975; 43 11.1,1.625; 44 11.1,2.275; 45 11.1,2.925; 46 11.1,3.575; 47 11.1,4.225; 48 11.1,4.875; 49 11.1,5.525; 50 11.1,6.175; 81 -11.1,6.175; 82 -11.1,5.525; 83 -11.1,4.875; 84 -11.1,4.225; 85 -11.1,3.575; 86 -11.1,2.925; 87 -11.1,2.275; 88 -11.1,1.625; 89 -11.1,0.975; 90 -11.1,0.325; 91 -11.1,-0.325; 92 -11.1,-0.975; 93 -11.1,-1.625; 94 -11.1,-2.275; 95 -11.1,-2.925; 96 -11.1,-3.575; 97 -11.1,-4.225; 98 -11.1,-4.875; 99 -11.1,-5.525; 100 -11.1,-6.175
DIL16 = drill 0.813 long: 1 -8.89,-3.81; 2 -6.35,-3.81; 3 -3.81,-3.81; 4 -1.27,-3.81; 5 1.27,-3.81; 6 3.81,-3.81; 7 6.35,-3.81; 8 8.89,-3.81; 9 8.89,3.81; 10 6.35,3.81; 11 3.81,3.81; 12 1.27,3.81; 13 -1.27,3.81; 14 -3.81,3.81; 15 -6.35,3.81; 16 -8.89,3.81
DIL14 = drill 0.813 long: 1 -7.62,-3.81; 2 -5.08,-3.81; 3 -2.54,-3.81; 4 0,-3.81; 5 2.54,-3.81; 6 5.08,-3.81; 7 7.62,-3.81; 8 7.62,3.81; 9 5.08,3.81; 10 2.54,3.81; 11 0,3.81; 12 -2.54,3.81; 13 -5.08,3.81; 14 -7.62,3.81
EDGE-CON8 = smd 2.032 x 13.106: AA1 261.303,7.938; AB1 258.127,7.938; AC1 254.952,7.938; AD1 251.778,7.938; AE1 248.602,7.938; AF1 245.428,7.938; AH1 242.252,7.938; AJ1 239.077,7.938; AK1 235.903,7.938; AL1 232.727,7.938; AM1 229.553,7.938; AN1 226.377,7.938; AP1 223.202,7.938; AR1 220.028,7.938; AS1 216.852,7.938; AT1 213.678,7.938; AU1 210.502,7.938; AV1 207.327,7.938; BA1 191.452,7.938; BB1 188.278,7.938; BC1 185.102,7.938; BD1 181.928,7.938; BE1 178.752,7.938; BF1 175.577,7.938; BH1 172.403,7.938; BJ1 169.227,7.938; BK1 166.053,7.938; BL1 162.877,7.938; BM1 159.702,7.938; BN1 156.528,7.938; BP1 153.352,7.938; BR1 150.178,7.938; BS1 147.002,7.938; BT1 143.827,7.938; BU1 140.653,7.938; BV1 137.477,7.938; CA1 127.953,7.938; CB1 124.778,7.938; CC1 121.603,7.938; CD1 118.427,7.938; CE1 115.252,7.938; CF1 112.078,7.938; CH1 108.903,7.938; CJ1 105.728,7.938; CK1 102.552,7.938; CL1 99.377,7.938; CM1 96.203,7.938; CN1 93.028,7.938; CP1 89.853,7.938; CR1 86.677,7.938; CS1 83.502,7.938; CT1 80.328,7.938; CU1 77.153,7.938; CV1 73.978,7.938; DA1 58.102,7.938; DB1 54.928,7.938; DC1 51.752,7.938; DD1 48.578,7.938; DE1 45.403,7.938; DF1 42.227,7.938; DH1 39.053,7.938; DJ1 35.877,7.938; DK1 32.703,7.938; DL1 29.527,7.938; DM1 26.352,7.938; DN1 23.177,7.938; DP1 20.003,7.938; DR1 16.828,7.938; DS1 13.652,7.938; DT1 10.477,7.938; DU1 7.303,7.938; DV1 4.128,7.938 | smd 2.032 x 13.106 bottom: AA2 261.303,7.938; AB2 258.127,7.938; AC2 254.952,7.938; AD2 251.778,7.938; AE2 248.602,7.938; AF2 245.428,7.938; AH2 242.252,7.938; AJ2 239.077,7.938; AK2 235.903,7.938; AL2 232.727,7.938; AM2 229.553,7.938; AN2 226.377,7.938; AP2 223.202,7.938; AR2 220.028,7.938; AS2 216.852,7.938; AT2 213.678,7.938; AU2 210.502,7.938; AV2 207.327,7.938; BA2 191.452,7.938; BB2 188.278,7.938; BC2 185.102,7.938; BD2 181.928,7.938; BE2 178.752,7.938; BF2 175.577,7.938; BH2 172.403,7.938; BJ2 169.227,7.938; BK2 166.053,7.938; BL2 162.877,7.938; BM2 159.702,7.938; BN2 156.528,7.938; BP2 153.352,7.938; BR2 150.178,7.938; BS2 147.002,7.938; BT2 143.827,7.938; BU2 140.653,7.938; BV2 137.477,7.938; CA2 127.953,7.938; CB2 124.778,7.938; CC2 121.603,7.938; CD2 118.427,7.938; CE2 115.252,7.938; CF2 112.078,7.938; CH2 108.903,7.938; CJ2 105.728,7.938; CK2 102.552,7.938; CL2 99.377,7.938; CM2 96.203,7.938; CN2 93.028,7.938; CP2 89.853,7.938; CR2 86.677,7.938; CS2 83.502,7.938; CT2 80.328,7.938; CU2 77.153,7.938; CV2 73.978,7.938; DA2 58.102,7.938; DB2 54.928,7.938; DC2 51.752,7.938; DD2 48.578,7.938; DE2 45.403,7.938; DF2 42.227,7.938; DH2 39.053,7.938; DJ2 35.877,7.938; DK2 32.703,7.938; DL2 29.527,7.938; DM2 26.352,7.938; DN2 23.177,7.938; DP2 20.003,7.938; DR2 16.828,7.938; DS2 13.652,7.938; DT2 10.477,7.938; DU2 7.303,7.938; DV2 4.128,7.938
MA05-2 = drill 1.016 octagon: 1 -5.08,-1.27; 2 -5.08,1.27; 3 -2.54,-1.27; 4 -2.54,1.27; 5 0,-1.27; 6 0,1.27; 7 2.54,-1.27; 8 2.54,1.27; 9 5.08,-1.27; 10 5.08,1.27
DEC40PINH = drill 0.914 octagon: A 24.13,1.27; AA -3.81,1.27; B 24.13,-1.27; BB -3.81,-1.27; C 21.59,1.27; CC -6.35,1.27; D 21.59,-1.27; DD -6.35,-1.27; E 19.05,1.27; EE -8.89,1.27; F 19.05,-1.27; FF -8.89,-1.27; H 16.51,1.27; HH -11.43,1.27; J 16.51,-1.27; JJ -11.43,-1.27; K 13.97,1.27; KK -13.97,1.27; L 13.97,-1.27; LL -13.97,-1.27; M 11.43,1.27; MM -16.51,1.27; N 11.43,-1.27; NN -16.51,-1.27; P 8.89,1.27; PP -19.05,1.27; R 8.89,-1.27; RR -19.05,-1.27; S 6.35,1.27; SS -21.59,1.27; T 6.35,-1.27; TT -21.59,-1.27; U 3.81,1.27; UU -24.13,1.27; V 3.81,-1.27; W 1.27,1.27; X 1.27,-1.27; Y -1.27,1.27; Z -1.27,-1.27 | drill 0.914: VV -24.13,-1.27
TO5 = drill 0.813 octagon: 1 0,-2.54; 2 2.54,0; 3 0,2.54
0207/10 = drill 0.813 octagon: 1 -5.08,0; 2 5.08,0
3006Y = drill 0.9: 1 -8.89,1.27; 2 1.27,-1.27; 3 8.89,1.27
0207/15 = drill 0.813 octagon: 1 -7.62,0; 2 7.62,0
OMNIBUS = hole 3.175: 208.915,209.55; 259.715,209.55; 189.865,209.55; 139.065,209.55; 75.616,209.55; 126.416,209.55; 56.566,209.55; 5.766,209.55
0R2/10 = drill 0.813 pad 1.6 octagon: 1 -5.08,0; 2 5.08,0; 3 15.24,0
B3F-31XX = drill 1.016 octagon: 1 -2.261,-1.245; 2 2.261,-1.245 | drill 1.499 pad 2.159: 3 -3.505,1.245; 4 3.505,1.245

### Placement (x,y rotation side)
C1  83.69,85.09 180 top
C2  74.8,85.09 180 top
C3  13.84,97.79 180 top
C4  134.49,185.42 180 top
C5  29.08,97.79 180 top
C6  58.29,27.94 90 top
C7  190.37,27.94 90 top
C8  126.87,27.94 90 top
C36  144.65,180.34 90 top
C37  27.81,71.12 180 top
C38  37.97,86.36 90 top
C39  131.95,157.48 180 top
C40  144.65,162.56 270 top
C41  49.4,190.5 270 top
C42  53.21,190.5 270 top
C44  84.96,190.5 0 top
C47  76.07,193.04 90 top
C48  73.53,152.4 0 top
D1  62.1,180.34 180 top
D2  62.1,193.04 180 top
D3  62.1,189.23 180 top
D4  62.1,186.69 180 top
D5  62.1,176.53 180 top
D6  62.1,182.88 180 top
D7  63.37,166.37 0 top
D9  63.37,171.45 0 top
D9A  63.37,163.83 0 top
D10  63.37,168.91 0 top
E1  78.61,73.66 0 top
E04  134.49,172.72 270 top
E08  29.08,85.09 270 top
E25  13.84,86.36 270 top
EDGE$3  -0.13,0 0 top
ISP  106.55,201.93 0 top
J1  26.54,170.18 90 top
Q1  49.4,179.07 0 top
Q2  95.12,190.5 90 top
Q3  88.77,182.88 90 top
Q4  76.07,160.02 90 top
Q5  76.07,170.18 90 top
R1  35.43,191.77 0 top
R4  35.43,194.31 0 top
R5  35.43,186.69 0 top
R7  35.43,176.53 0 top
R11  91.31,177.8 0 top
R16  65.91,154.94 90 top
R17  140.84,184.15 90 top
R18  96.39,154.94 90 top
R22  22.73,93.98 270 top
R23  27.81,67.31 180 top
R24  40.51,88.9 90 top
R25  140.84,166.37 90 top
R26  117.98,196.85 90 top
R27  74.8,186.69 180 top
R29  74.8,182.88 0 top
R30  88.77,172.72 180 top
R31  88.77,170.18 180 top
R32  88.77,163.83 180 top
R33  88.77,161.29 180 top
R34  88.77,158.75 180 top
R35  86.23,152.4 180 top
R36  90.04,166.37 0 top
R37  50.67,172.72 180 top
R38  50.67,166.37 0 top
R39  50.67,163.83 0 top
R40  50.67,170.18 0 top
R41  74.8,176.53 180 top
R42  68.45,154.94 270 top
R43  128.14,171.45 90 top
R48  74.8,180.34 180 top
U$1  -0.13,0 0 top
W2W1  106.55,68.58 90 top
W4W3  111.63,68.58 90 top
WTM  151,190.5 180 top

### Tracks (layer width: path | path; a pad name or v marks a point on that pad's centre or on a via)
!CC_TPG_CLK
  Top 0.305: 141.48,162.56 144.34,165.42 144.34,165.74 C40.1 | 141.48,162.56 140.84,161.93 R25.1 | 141.48,162.56 138.3,165.74 E04.10
!DF_SEL_ER  (via drill 0.51)
  Top 0.305: v72.9,96.84 73.22,96.52 73.22,82.55 E1.74 | v77.98,101.92 78.3,102.23 78.3,142.88 86.23,150.81 R11.1 Q3.3 86.23,185.1 v87.5,186.37
  Bottom 0.305: v77.98,101.92 v72.9,96.84 | v87.5,186.37 87.82,186.37 91.95,190.5 Q2.3
!INT_RQST  (via drill 0.51)
  Top 0.305: v77.66,25.72 77.66,64.77 E1.14 | v88.14,15.24 89.09,14.29 EDGE$3.CP1
  Bottom 0.305: v88.14,15.24 v77.66,25.72
!POWER_OK  (via drill 0.51)
  Top 0.305: v84.65,67.31 84.65,66.36 E1.25 | v96.39,68.26 97.98,66.67 v97.98,59.69
  Bottom 0.305: v84.65,67.31 85.6,68.26 v96.39,68.26 | v97.98,59.69 136.4,21.27 137.67,21.27 138.3,20.64 138.3,17.14 137.67,16.51 137.67,14.29 EDGE$3.BV2
!RTT  (via drill 0.51)
  Top 0.305: v74.48,80.01 74.48,80.96 E1.72 | v84.96,87.31 96.39,98.74 R18.1 | v34.8,185.1 53.21,166.69 v53.21,164.78 | v85.28,151.13 v77.66,158.75
  Bottom 0.305: v74.48,80.01 77.66,83.19 80.84,83.19 v84.96,87.31 | v34.8,185.1 29.72,185.1 28.45,186.37 J1.J | v53.21,164.78 59.25,158.75 v77.66,158.75 | v85.28,151.13 86.55,149.86 R18.1
!SKIP
  Top 0.305: E1.11 75.76,64.77 75.76,63.18 76.71,62.23 76.71,20.32 82.74,14.29 EDGE$3.CS1
-1.5V
  Top 0.305: D5.A 57.02,177.16 56.07,178.12 56.07,185.1 57.02,186.06 D4.A
  Bottom 0.305: C42.2 53.85,187.96 55.12,186.69 D4.A 64.01,186.69 66.55,189.23 D3.C
-3V  (via drill 0.51)
  Top 0.305: D6.C R29.1 | v55.12,181.61 49.4,187.32 C41.2
  Bottom 0.305: v55.12,181.61 56.39,180.34 D1.A 64.01,180.34 66.55,182.88 D6.C
-4.7V
  Top 0.305: R35.2 C48.2 Q4.2
  Bottom 0.305: Q4.2 76.71,162.56 80.52,166.37 R36.1
-9V  (via drill 0.51)
  Top 0.305: R38.2 55.75,167 54.8,167.96 54.8,171.13 55.75,172.09 R37.1 | C44.2 87.5,189.87 88.77,188.59 Q3.2 | v76.71,181.29 v70.04,174.62
  Bottom 0.305: v70.04,174.62 58.29,174.62 56.39,172.72 R37.1 | v76.71,181.29 80.84,185.42 Q3.2
-15V
  Top 0.305: R30.1 R31.1 R32.1 R33.1 R34.1 R35.1 | R39.1 R38.1 R40.1 | R41.1 79.88,177.16 78.93,178.12 78.93,181.29 79.88,182.25 R29.2
  Bottom 0.305: R40.1 46.23,170.18 51.62,175.58 78.3,175.58 79.25,176.53 R41.1 89.41,176.53 93.22,172.72 R30.1 | EDGE$3.DB2 54.16,14.29 45.59,22.86 R39.1
C0  (via drill 0.51)
  Top 0.305: v83.38,67.31 83.38,66.36 E1.23 | v89.09,64.77 89.73,64.14 89.73,39.05 114.49,14.29 EDGE$3.CE1
  Bottom 0.305: v83.38,67.31 85.92,64.77 v89.09,64.77
C1  (via drill 0.51)
  Top 0.305: v82.74,43.5 82.74,64.77 E1.22 | v108.78,17.46 109.41,16.83 109.41,14.29 EDGE$3.CH1
  Bottom 0.305: v108.78,17.46 v82.74,43.5
CC_DTP  (via drill 0.51)
  Top 0.305: v87.19,77.79 89.09,77.79 E1.47 | v39.56,86.36 v46.54,79.38
  Bottom 0.305: v87.19,77.79 86.55,78.42 70.04,78.42 69.09,79.38 v46.54,79.38 | E08.13 v39.56,86.36
CC_SETDLY  (via drill 0.51)
  Top 0.305: v78.3,79.38 78.3,66.36 E1.15 | v129.73,127 129.73,177.48 130.68,178.44 E04.2
  Bottom 0.305: v78.3,79.38 83.06,84.14 86.87,84.14 v129.73,127
CC_T/M_EN  (via drill 0.51)
  Top 0.305: E04.11 152.59,168.91 152.59,191.45 WTM.1 | v84.01,132.4 84.01,82.55 E1.57
  Bottom 0.305: R16.1 66.55,149.86 v84.01,132.4 110.36,158.75 127.51,158.75 137.67,168.91 E04.11
CC_TPG_CLK  (via drill 0.51)
  Top 0.305: v70.36,99.38 62.74,91.76 62.74,74.61 66.87,74.61 E1.89 | E04.5 130.68,170.81 137.67,163.83 E04.9
  Bottom 0.305: v70.36,99.38 134.81,163.83 E04.9
CC_TT_EN  (via drill 0.51)
  Top 0.305: v87.5,86.04 87.5,82.55 E1.52 | v46.54,89.53 42.73,85.72 v42.73,84.45
  Bottom 0.305: v87.5,86.04 84.01,89.53 v46.54,89.53 | v42.73,84.45 37.02,78.74 E08.10
CON_ALL_HALT  (via drill 0.51)
  Top 0.305: v61.79,68.26 66.87,68.26 E1.99 | v57.97,72.07 47.5,82.55 47.5,100.33 31.94,115.89 v31.94,146.69
  Bottom 0.305: v57.97,72.07 v61.79,68.26 | v31.94,146.69 28.13,150.5 J1.RR
DATA00  (via drill 0.51)
  Top 0.305: v87.82,74.61 89.09,74.61 E1.42 | v156.72,76.83 219.27,14.29 EDGE$3.AR1
  Bottom 0.305: v87.82,74.61 90.04,76.83 v156.72,76.83
DATA01  (via drill 0.51)
  Top 0.305: v91.63,72.71 90.36,72.71 E1.39 | v158.62,71.75 216.09,14.29 EDGE$3.AS1
  Bottom 0.305: v91.63,72.71 105.92,72.71 106.87,71.75 v158.62,71.75
DATA02  (via drill 0.51)
  Top 0.305: v86.87,72.07 89.09,72.07 E1.38 | v100.52,74.93 v109.73,65.72 | v207.2,19.05 209.74,16.51 209.74,14.29 EDGE$3.AU1
  Bottom 0.305: v86.87,72.07 87.19,72.39 89.09,72.39 91.63,74.93 v100.52,74.93 | v109.73,65.72 159.26,65.72 205.93,19.05 v207.2,19.05
DATA03  (via drill 0.51)
  Top 0.305: v87.82,71.12 87.82,71.44 89.09,71.44 E1.37 | v158.62,66.67 206.25,19.05 206.25,14.29 EDGE$3.AV1
  Bottom 0.305: v87.82,71.12 154.18,71.12 v158.62,66.67
DATA04  (via drill 0.51)
  Top 0.305: v86.87,70.17 87.82,69.22 87.82,67.63 89.09,67.63 E1.31 | v101.79,70.17 110.68,61.28 110.68,55.88 149.41,17.14 149.41,14.29 EDGE$3.BR1
  Bottom 0.305: v86.87,70.17 v101.79,70.17
DATA05  (via drill 0.51)
  Top 0.305: v90.04,65.72 88.14,65.72 E1.30 | v92.9,65.41 v97.03,61.28 | v145.29,15.24 146.24,14.29 EDGE$3.BS1
  Bottom 0.305: v90.04,65.72 90.36,65.41 v92.9,65.41 | v97.03,61.28 97.66,60.64 98.93,60.64 144.34,15.24 v145.29,15.24
DATA06  (via drill 0.51)
  Top 0.305: v87.5,63.82 87.5,64.77 E1.29 | v134.81,19.37 v91,63.18 | v137.35,19.05 138.62,17.78 v138.62,16.19 | EDGE$3.BU1 v140.53,16.19
  Bottom 0.305: v87.5,63.82 88.14,63.18 v91,63.18 | v134.81,19.37 135.13,19.05 v137.35,19.05 | v140.53,16.19 v138.62,16.19
DATA07  (via drill 0.51)
  Top 0.305: v85.6,69.22 85.6,66.36 E1.26 | v97.34,69.22 104.33,62.23 104.33,57.78 136.4,25.72 136.4,14.29 EDGE$3.BV1
  Bottom 0.305: v97.34,69.22 v85.6,69.22
DATA08  (via drill 0.51)
  Top 0.305: v70.99,63.18 70.99,64.77 E1.4 | v46.54,43.5 17.34,14.29 EDGE$3.DR1
  Bottom 0.305: v70.99,63.18 51.31,43.5 v46.54,43.5
DATA09  (via drill 0.51)
  Top 0.305: v53.21,46.67 70.36,63.82 70.36,64.77 E1.3 | v46.54,46.67 14.16,14.29 EDGE$3.DS1
  Bottom 0.305: v46.54,46.67 v53.21,46.67
DATA10  (via drill 0.51)
  Top 0.305: v69.72,67.31 69.72,66.36 E1.2 | v58.93,65.72 7.81,14.61 7.81,14.29 EDGE$3.DU1
  Bottom 0.305: v69.72,67.31 68.14,65.72 v58.93,65.72
DATA11  (via drill 0.51)
  Top 0.305: v69.09,63.82 69.09,64.77 E1.1 | v46.54,56.2 4.64,14.29 EDGE$3.DV1
  Bottom 0.305: v69.09,63.82 61.47,56.2 v46.54,56.2
F/!R  (via drill 0.51)
  Top 0.305: v35.43,140.65 35.43,129.86 60.83,104.46 60.83,67.31 66.87,67.31 E1.100
  Bottom 0.305: v35.43,140.65 28.13,147.96 J1.TT
GND  (via drill 0.51)
  Top 0.305: v69.41,69.53 68.14,69.53 E1.97 | v69.41,75.25 68.14,75.25 E1.88 | v77.03,67.31 77.03,66.36 E1.13 | v86.87,67.31 86.87,66.36 E1.28 | E1.76 71.95,82.55 71.95,84.77 C2.2 | v87.82,73.34 89.09,73.34 E1.40 | E1.61 81.47,82.55 81.47,84.77 C1.2 | v87.82,76.52 89.09,76.52 E1.45 | v9.71,15.24 9.71,14.29 EDGE$3.DT1 | v22.42,15.24 22.42,14.29 EDGE$3.DN1 | v41.47,15.24 41.47,14.29 EDGE$3.DF1 | EDGE$3.DC2 50.99,14.29 v50.99,15.24 | v79.56,15.24 79.56,14.29 EDGE$3.CT1 | v92.27,15.24 92.27,14.29 EDGE$3.CN1 | v111.31,15.24 111.31,14.29 EDGE$3.CF1 | EDGE$3.CC2 120.84,14.29 v120.84,15.24 | v143.06,15.24 143.06,14.29 EDGE$3.BT1 | EDGE$3.BF2 174.81,14.29 v174.81,15.24 | EDGE$3.BC2 184.34,14.29 v184.34,15.24 | v212.91,15.24 212.91,14.29 EDGE$3.AT1 | v225.62,15.24 225.62,14.29 EDGE$3.AN1 | v244.66,15.24 244.66,14.29 EDGE$3.AF1
  Bottom 0.305: EDGE$3.DT1 9.71,14.29 v9.71,15.24 | EDGE$3.DN1 22.42,14.29 v22.42,15.24 | EDGE$3.DF1 41.47,14.29 v41.47,15.24 | v50.99,15.24 50.99,14.29 EDGE$3.DC2 | EDGE$3.CT1 79.56,14.29 v79.56,15.24 | EDGE$3.CN1 92.27,14.29 v92.27,15.24 | EDGE$3.CF1 111.31,14.29 v111.31,15.24 | v120.84,15.24 120.84,14.29 EDGE$3.CC2 | EDGE$3.BT1 143.06,14.29 v143.06,15.24 | v155.77,15.24 155.77,14.29 EDGE$3.BN2 | v174.81,15.24 174.81,14.29 EDGE$3.BF2 | v184.34,15.24 184.34,14.29 EDGE$3.BC2 | EDGE$3.AT1 212.91,14.29 v212.91,15.24 | EDGE$3.AN1 225.62,14.29 v225.62,15.24 | EDGE$3.AF1 244.66,14.29 v244.66,15.24 | v254.19,15.24 254.19,14.29 EDGE$3.AC2
  pour GND$: 0,0 265.3,0 265.3,214.63 0,214.63
INITIALIZE  (via drill 0.51)
  Top 0.305: v76.71,63.82 76.39,64.14 76.39,64.77 E1.12 | v83.69,63.18 83.69,16.51 85.92,14.29 EDGE$3.CR1
  Bottom 0.305: v76.71,63.82 77.34,63.18 v83.69,63.18
INTERNAL_IO  (via drill 0.51)
  Top 0.305: v80.2,32.7 80.2,64.77 E1.18 | v97.66,15.24 98.62,14.29 EDGE$3.CL1
  Bottom 0.305: v97.66,15.24 v80.2,32.7
IO_PAUSE  (via drill 0.51)
  Top 0.305: v84.65,47.31 84.65,63.5 84.01,64.14 84.01,64.77 E1.24 | v116.71,15.24 117.67,14.29 EDGE$3.CD1
  Bottom 0.305: v116.71,15.24 v84.65,47.31
MD03  (via drill 0.51)
  Top 0.305: v105.28,75.88 90.36,75.88 E1.44 | v161.8,74.93 222.44,14.29 EDGE$3.AP1
  Bottom 0.305: v105.28,75.88 106.23,74.93 v161.8,74.93
MD04  (via drill 0.51)
  Top 0.305: v95.44,66.04 95.44,70.17 90.36,70.17 E1.35 | v114.81,64.77 165.29,14.29 EDGE$3.BK1
  Bottom 0.305: v95.44,66.04 96.71,64.77 v114.81,64.77
MD05  (via drill 0.51)
  Top 0.305: v94.49,67.31 94.49,69.53 90.36,69.53 E1.34 | v110.68,66.99 162.12,15.56 162.12,14.29 EDGE$3.BL1
  Bottom 0.305: v94.49,67.31 94.81,66.99 v110.68,66.99
MD06  (via drill 0.51)
  Top 0.305: v135.44,25.4 130.05,25.4 91.95,63.5 91.95,68.9 90.36,68.9 E1.33 | v151,22.23 158.94,14.29 EDGE$3.BM1
  Bottom 0.305: v135.44,25.4 138.62,22.23 v151,22.23
MD07  (via drill 0.51)
  Top 0.305: v91,64.45 91,68.26 90.36,68.26 E1.32 | v108.14,57.78 108.14,63.18 107.19,63.18 W2W1.1 | v130.05,39.37 152.59,16.83 152.59,14.29 EDGE$3.BP1
  Bottom 0.305: v91,64.45 91.63,63.82 105.92,63.82 W2W1.1 | v108.14,57.78 126.56,39.37 v130.05,39.37
MD08  (via drill 0.51)
  Top 0.305: E1.10 75.12,64.77 v75.12,62.55 74.8,62.23 74.8,60.96 57.02,43.18 57.02,38.1 33.21,14.29 EDGE$3.DK1
  Bottom 0.305: v75.12,62.55 75.44,62.23 110.05,62.23 111,63.18 W4W3.1
MD09  (via drill 0.51)
  Top 0.305: v74.48,67.31 74.48,66.36 E1.9 | v68.14,64.77 49.09,45.72 49.09,33.34 30.04,14.29 EDGE$3.DL1
  Bottom 0.305: v74.48,67.31 71.95,64.77 v68.14,64.77
MD10  (via drill 0.51)
  Top 0.305: v73.85,61.28 73.85,64.77 E1.8 | v46.54,33.97 26.86,14.29 EDGE$3.DM1
  Bottom 0.305: v46.54,33.97 v73.85,61.28
MD11  (via drill 0.51)
  Top 0.305: v50.04,40.64 73.22,63.82 73.22,64.77 E1.7 | v46.54,40.64 20.51,14.61 20.51,14.29 EDGE$3.DP1
  Bottom 0.305: v46.54,40.64 v50.04,40.64
N$1  (via drill 0.61)
  other vias: 108.46,16.19
N$17  (via drill 0.51)
  Top 0.305: v62.74,72.71 66.87,72.71 E1.92 | v46.54,73.03 38.29,81.28 E08.11 32.26,81.28 25.27,88.27 E08.3
  Bottom 0.305: R22.2 E08.3 | v62.74,72.71 62.42,73.03 v46.54,73.03
N$51
  Top 0.305: D1.C R48.2
  Bottom 0.305: Q1.2 52.58,179.07 52.9,179.39 65.59,179.39 66.55,180.34 D1.C
N$52
  Top 0.305: D5.C R41.2
  Bottom 0.305: Q1.1 50.04,176.53 50.99,177.48 65.59,177.48 66.55,176.53 D5.C
N$53  (via drill 0.51)
  Top 0.305: v72.26,140.65 72.26,98.11 70.99,96.84 70.99,82.55 E1.77 | v54.16,158.75 54.16,175.26 49.4,180.02 Q1.3
  Bottom 0.305: v54.16,158.75 v72.26,140.65 | R27.1 79.25,186.69 76.39,183.83 52.26,183.83 50.04,181.61 Q1.3
N$54
  Bottom 0.305: D3.A 57.66,189.23 61.47,193.04 D2.C
N$55
  Top 0.305: R40.2 56.39,170.18 57.66,171.45 D9.C D10.C
N$56
  Top 0.305: D6.A 66.23,182.88 66.23,185.1 67.18,186.06 D4.C
N$57
  Bottom 0.305: D10.A 69.09,168.91 69.41,169.23 77.03,169.23 77.98,170.18 Q5.1
N$58  (via drill 0.51)
  Top 0.305: v77.03,179.39 69.09,171.45 D9.A
  Bottom 0.305: v77.03,179.39 87.19,179.39 90.68,182.88 Q3.1
N$59  (via drill 0.51)
  Top 0.305: v85.28,180.34 v73.22,168.28
  Bottom 0.305: v73.22,168.28 72.9,168.28 D9A.A | v85.28,180.34 95.44,190.5 Q2.1
N$60
  Top 0.305: D7.A 78.61,166.37 Q4.1
N$61
  Top 0.305: E1.46 90.36,77.15 106.23,77.15 106.23,74.3 W2W1.2
N$62
  Top 0.305: E1.48 90.36,78.42 111.31,78.42 111.31,74.3 W4W3.2
N$63
  Top 0.305: R39.2 D9A.C D7.C
N$65  (via drill 0.51)
  Top 0.305: v85.6,80.01 78.93,73.34 78.93,66.36 E1.16
  Bottom 0.305: v85.6,80.01 89.09,83.5 105.92,83.5 W2W1.3
N$67  (via drill 0.51)
  Top 0.305: v89.41,82.55 88.14,82.55 E1.51
  Bottom 0.305: v89.41,82.55 110.05,82.55 111,83.5 W4W3.3
N$77
  Top 0.305: E08.5 25.27,84.45 24.32,85.41 24.32,89.85 25.27,90.81 E08.2
N$78
  Top 0.305: R23.1 C37.1
  Bottom 0.305: E08.7 25.27,78.11 31.94,71.44 32.26,71.44 C37.1
N$79
  Top 0.305: R24.1 C38.1 37.97,85.72 32.89,90.81 E08.15
N$80  (via drill 0.51)
  Top 0.305: v63.69,73.66 63.69,73.34 66.87,73.34 E1.91 | v46.54,74.3 45.91,74.3 36.39,83.82 E08.12
  Bottom 0.305: v63.69,73.66 63.05,74.3 v46.54,74.3
N$81
  Bottom 0.305: E08.14 C38.2
N$82
  Top 0.305: E08.6 25.27,80.64 23.05,78.42 23.05,71.75 C37.2
N$92  (via drill 0.51)
  Top 0.305: v64.64,85.72 64.64,77.15 66.87,77.15 E1.85 | v61.79,88.58 62.1,88.9 62.1,142.88 68.45,149.22 R42.2
  Bottom 0.305: v61.79,88.58 v64.64,85.72 | E04.3 130.05,176.53 115.76,162.24 82.42,162.24 70.04,149.86 R42.2
N$94
  Top 0.305: C36.+ 144.34,170.81 140.84,174.31 R17.1
  Bottom 0.305: R17.1 E04.15
N$95
  Top 0.305: E04.14 138.3,177.16 139.89,178.75 139.89,185.42 144.34,189.87 C36.-
N$96  (via drill 0.51)
  Top 0.305: v63.69,90.49 63.69,75.88 66.87,75.88 E1.87 | v125.6,152.08 v125.6,168.28
  Bottom 0.305: v63.69,90.49 65.91,92.71 66.23,92.71 v125.6,152.08 | v125.6,168.28 130.68,173.35 E04.4
N$108
  Top 0.305: C39.1 136.72,158.12 131.63,163.19 131.63,164.78 130.68,165.74 E04.7
  Bottom 0.305: R43.1 E04.7
N$110  (via drill 0.51)
  Top 0.305: v128.14,167.96 127.19,167 127.19,158.12 C39.2
  Bottom 0.305: v128.14,167.96 129.09,167.96 130.05,168.91 E04.6
N$111
  Top 0.305: R43.2 127.51,176.53 117.03,187.01 117.03,187.32 R26.1
N$112
  Top 0.305: E04.12 R25.2
ND0  (via drill 0.51)
  Top 0.305: v65.59,78.11 65.59,78.42 66.87,78.42 E1.83 | v59.88,78.42 49.72,88.58 v49.72,91.44 | v46.54,94.61 30.99,110.17 30.99,157.8 28.13,160.66 J1.FF
  Bottom 0.305: v65.59,78.11 65.28,78.42 v59.88,78.42 | v49.72,91.44 v46.54,94.61
ND1  (via drill 0.51)
  Top 0.305: v65.91,93.66 65.91,79.06 66.87,79.06 E1.82 | v46.54,113.03 34.48,125.09 34.48,156.84 28.13,163.19 J1.DD
  Bottom 0.305: v65.91,93.66 v46.54,113.03
ND2  (via drill 0.51)
  Top 0.305: v69.72,97.47 69.72,82.55 E1.79 | v47.82,119.38 47.5,119.7 47.5,151.45 28.13,170.81 J1.X
  Bottom 0.305: v69.72,97.47 v47.82,119.38
RD00  (via drill 0.51)
  Top 0.305: v75.76,138.43 75.76,82.55 E1.70 | v36.07,178.12 32.89,181.29 v32.89,186.37
  Bottom 0.305: v75.76,138.43 v36.07,178.12 | v32.89,186.37 28.13,191.13 J1.D 28.45,192.09 28.77,192.09 30.35,193.68 R4.1
RD01  (via drill 0.51)
  Top 0.305: v73.85,133.99 73.85,82.55 E1.73 | v46.54,161.29 32.26,175.58 32.26,184.15 31.31,185.1 | 31.31,185.1 30.35,186.06 R5.1 | 31.31,185.1 v30.35,184.15
  Bottom 0.305: v73.85,133.99 v46.54,161.29 | v30.35,184.15 J1.L
RD02  (via drill 0.51)
  Top 0.305: v71.31,130.18 71.31,97.79 70.36,96.84 70.36,82.55 E1.78 | v46.54,154.94 28.13,173.35 J1.V
  Bottom 0.305: v71.31,130.18 v46.54,154.94 | R7.1 30.35,175.9 28.77,174.31 28.45,174.31 J1.V
RMT  (via drill 0.51)
  Top 0.305: v73.22,137.79 75.12,135.89 75.12,82.55 E1.71 | v29.4,179.07 29.08,179.39 29.08,187.64 28.13,188.59 J1.F 28.45,189.55 28.45,189.87 R1.1
  Bottom 0.305: v73.22,137.79 45.59,165.42 43.05,165.42 v29.4,179.07
RUN  (via drill 0.51)
  Top 0.305: v88.77,61.28 86.23,63.82 86.23,64.77 E1.27 | v137.35,20.32 139.57,18.1 v139.57,15.24
  Bottom 0.305: v88.77,61.28 129.73,20.32 v137.35,20.32 | v139.57,15.24 140.53,14.29 EDGE$3.BU2
S/!G  (via drill 0.51)
  Top 0.305: v65.59,71.75 65.59,70.8 66.87,70.8 E1.95 | v53.53,75.25 44.64,84.14 v44.64,86.36 | v44.64,93.98 29.08,109.54 29.08,157.16 28.13,158.12 J1.JJ
  Bottom 0.305: v65.59,71.75 65.59,75.25 v53.53,75.25 | v44.64,86.36 v44.64,93.98
SEL_ECHO  (via drill 0.51)
  Top 0.305: R34.2 R33.2 R32.2 R31.2 R30.2 | v91.31,173.35 93.54,175.58 93.54,190.82 95.12,192.41 Q2.2 | v77.03,178.12 76.07,177.16 Q5.2
  Bottom 0.305: Q5.2 R30.2 90.68,172.72 v91.31,173.35 | v77.03,178.12 51.31,178.12 50.36,179.07 30.67,179.07 28.45,181.29 J1.N
T/M_ENABLE  (via drill 0.51)
  Top 0.305: v62.74,69.22 62.74,68.9 66.87,68.9 E1.98 | v59.88,72.07 48.45,83.5 v48.45,91.44 | v46.54,93.34 30.04,109.86 v30.04,151.13
  Bottom 0.305: v59.88,72.07 v62.74,69.22 | v48.45,91.44 v46.54,93.34 | v30.04,151.13 28.13,153.03 J1.NN
TCK
  Top 0.305: E1.64 79.56,82.55 79.56,136.53 99.25,156.21 99.25,198.12 101.16,200.03 ISP.1
TDI  (via drill 0.51)
  Top 0.305: v72.58,68.26 72.58,66.36 E1.6 | v94.17,81.6 101.16,88.58 101.16,190.5 111,200.34 ISP.9
  Bottom 0.305: v72.58,68.26 79.88,75.56 88.14,75.56 v94.17,81.6
TDO  (via drill 0.51)
  Top 0.305: v72.58,80.01 72.58,80.96 E1.75 | v78.61,84.14 78.93,84.45 78.93,142.88 90.36,154.31 90.36,192.09 100.2,201.93 102.74,201.93 ISP.3
  Bottom 0.305: v72.58,80.01 76.71,84.14 v78.61,84.14
TMS
  Top 0.305: E1.17 79.56,66.36 79.56,71.44 100.2,92.08 100.2,193.99 106.23,200.03 ISP.5
TP3  (via drill 0.51)
  Top 0.305: v81.79,40.64 81.79,43.81 82.11,44.13 82.11,64.77 E1.21
  Bottom 0.305: v81.79,40.64 108.14,14.29 EDGE$3.CH2
TP4  (via drill 0.51)
  Top 0.305: v80.84,67.31 80.84,66.36 E1.19 | v85.6,63.18 87.19,61.59 v87.19,32.07
  Bottom 0.305: v80.84,67.31 84.96,63.18 v85.6,63.18 | v87.19,32.07 104.97,14.29 EDGE$3.CJ2
UNITH  (via drill 0.51)
  Top 0.305: v61.79,86.68 61.79,70.17 66.87,70.17 E1.96 | v59.88,88.58 34.48,113.98 v34.48,123.83
  Bottom 0.305: v61.79,86.68 v59.88,88.58 | v34.48,123.83 26.54,131.76 26.54,155.89 27.18,155.89 J1.LL
VCC  (via drill 0.51)
  Top 0.305: E1.93 68.14,72.07 v69.41,72.07 69.09,72.39 69.09,73.98 68.14,73.98 E1.90 | v69.41,77.79 68.14,77.79 E1.84 | v71.63,67.31 71.63,66.36 E1.5 | v82.11,67.31 81.47,66.67 81.47,66.36 E1.20 | E1.36 90.36,70.8 92.58,70.8 v92.58,73.66 92.27,73.98 90.36,73.98 E1.41 | E1.68 77.03,82.55 77.03,84.77 C2.1 | E1.53 86.87,82.55 86.87,85.09 C1.1
  Bottom 0.305: EDGE$3.CA2 127.19,14.29 127.19,17.14 C8.+ | EDGE$3.BA2 190.69,14.29 190.69,17.14 C7.+ | v260.54,15.24 260.54,14.29 EDGE$3.AA2
  pour VCC$: 0,0 265.3,0 265.3,214.63 0,214.63
WD_ENAB  (via drill 0.51)
  Top 0.305: v67.82,95.57 67.82,83.82 69.09,82.55 E1.80 | v47.5,115.89 v36.7,126.68 | v36.7,159.7 28.13,168.28 J1.Z
  Bottom 0.305: v67.82,95.57 v47.5,115.89 | v36.7,126.68 v36.7,159.7
WPT  (via drill 0.51)
  Top 0.305: v66.87,94.61 66.87,80.01 E1.81 | v46.54,120.02 36.7,129.86 36.7,157.16 28.13,165.74 J1.BB
  Bottom 0.305: v66.87,94.61 46.54,114.94 v46.54,120.02
WRT_ECHO  (via drill 0.51)
  Top 0.305: v77.98,181.29 76.07,183.2 v76.07,184.78 C47.1 | v31.31,180.02 31.31,179.71 28.45,176.85 J1.T
  Bottom 0.305: v77.98,181.29 78.3,181.29 79.25,180.34 R48.1 | v31.31,180.02 36.07,184.78 v76.07,184.78

### Text on the board
Top: OFF | WTM | + | W1 | W3 | W2 | W4 | SIDE 1 | + | + | +
Bottom: TAPE | DEC | CONTROL M868H | SIMPLE | SIDE 2